# EAGLE design SenseBox-MCU-2-2 (EAGLE 9.6.2)

## Sheet 1 of 2
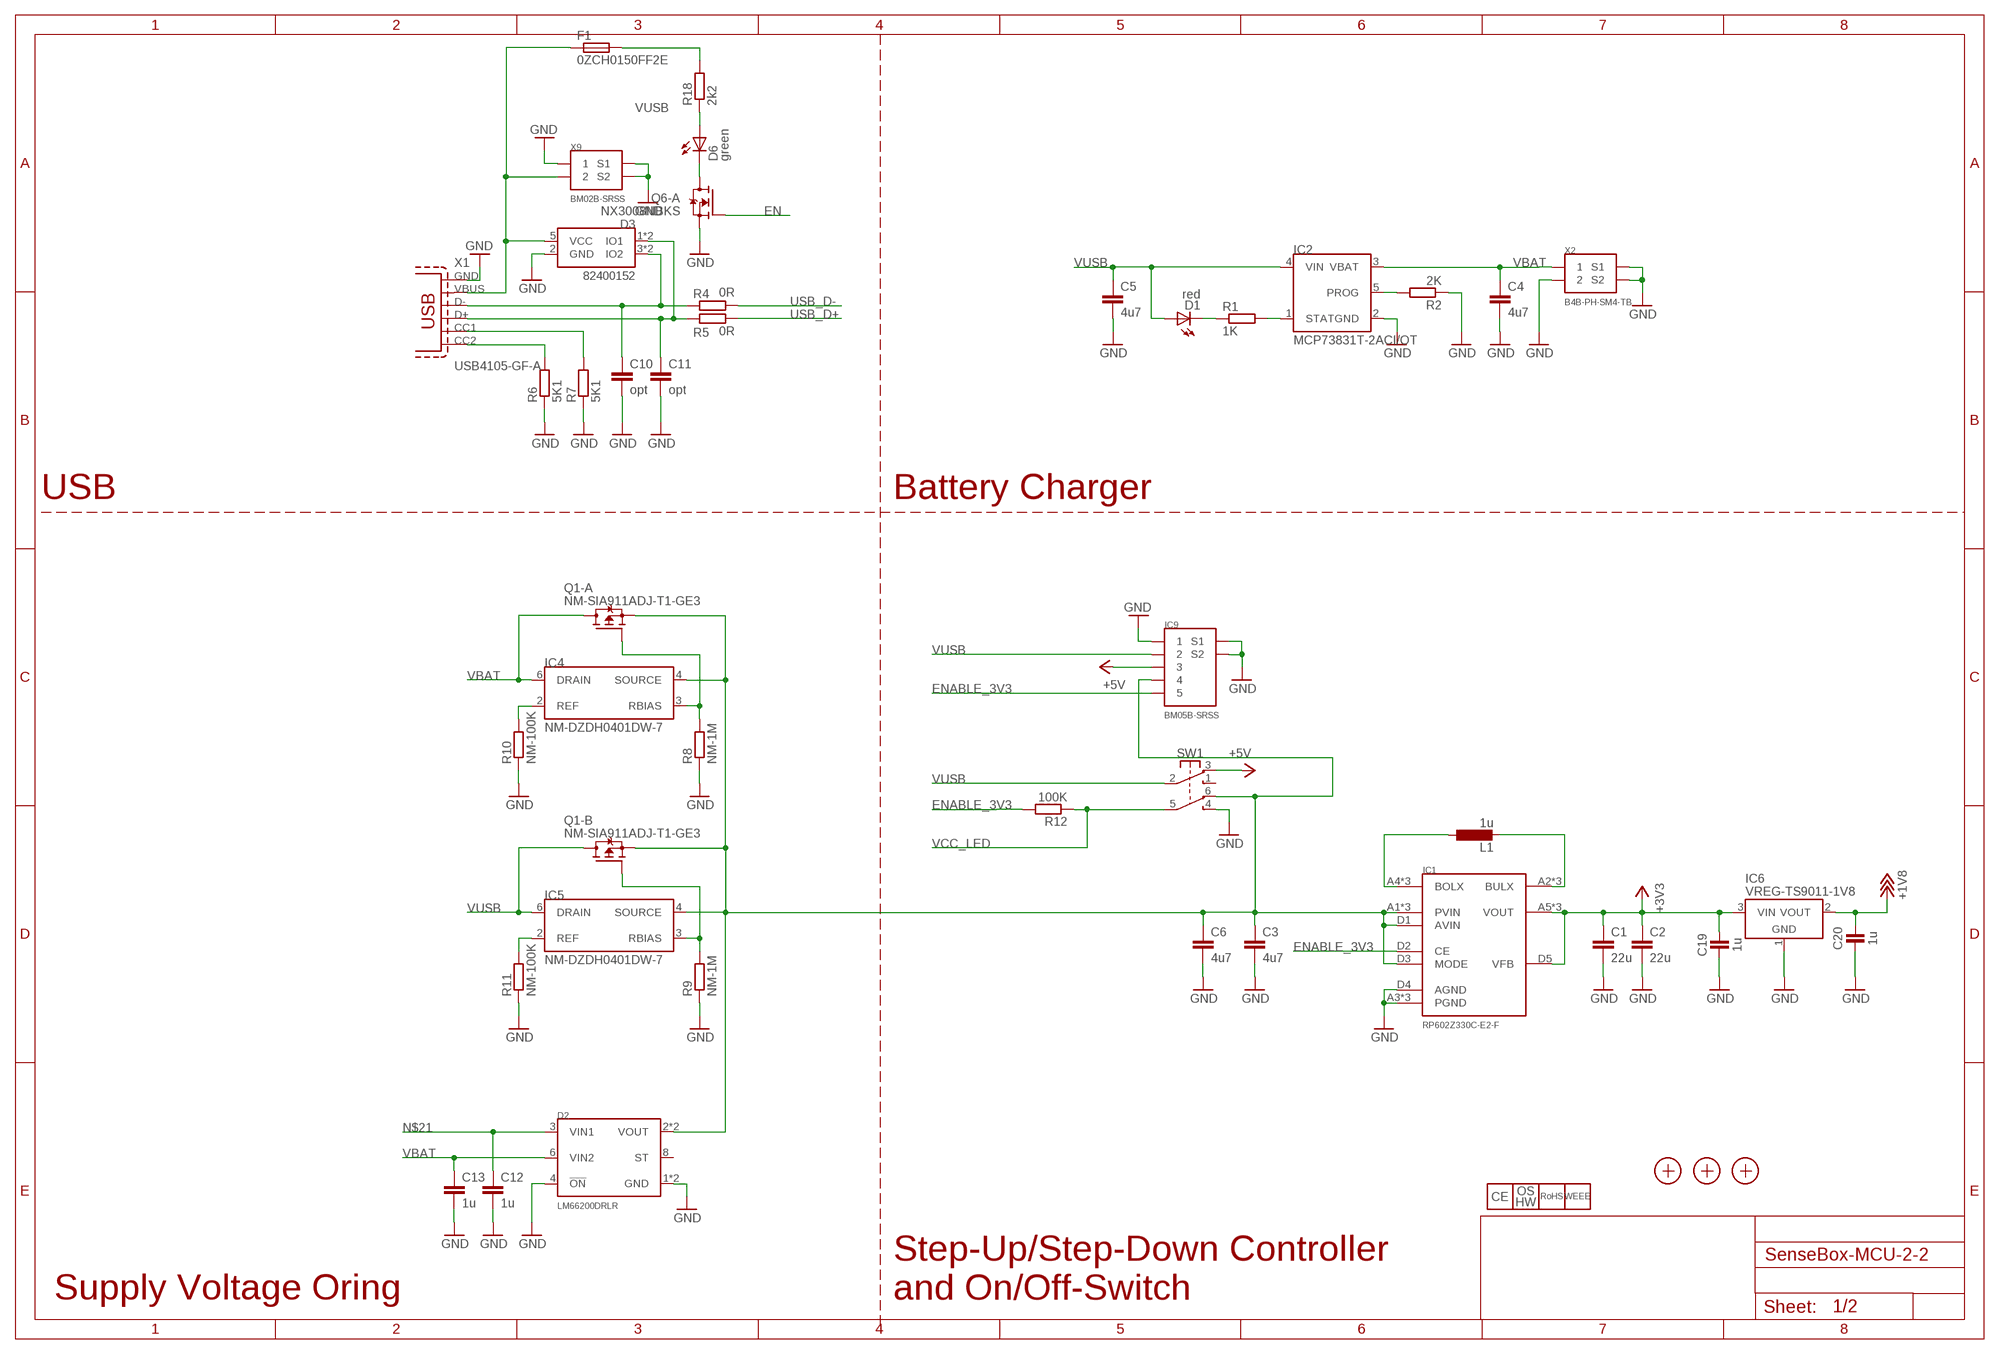
[diagram p0: schematic, sheet 1]

### Parts
C1  22u  C_22U_0805N  [0805N]
C2  22u  C_22U_0805N  [0805N]
C3  4u7  C_4U7_0603N  [0603N]
C4  4u7  C_4U7_0603N  [0603N]
C5  4u7  C_4U7_0603N  [0603N]
C6  4u7  C_4U7_0603N  [0603N]
C10  opt  C_0402N  [0402N]
C11  opt  C_0402N  [0402N]
C12  1u  C_1U_0402N  [0402N]
C13  1u  C_1U_0402N  [0402N]
C19  1u  CAPACITOR-0402  [C0402]
C20  1u  CAPACITOR-0402  [C0402]
D1  red  LED_RED_0603N  [0603N]
D2  LM66200DRLR  LM66200  [SOT-5X3]
D3  82400152  TVS-3-CHANNELS_WE-TVS_SOT563  [SOT563]
D6  green  LED_GREEN_0603N  [0603N]
F1  0ZCH0150FF2E  FUSE-2PIN_1.5A_1210N  [1210N]
IC1  RP602Z330C-E2-F  RP602_RP602Z330C-E2-F_WLCSP-20-P1  [WLCSP-20-P1]
IC2  MCP73831T-2ACI/OT  MCP73831_MCP73831T-2ACI/OT_SOT23-5  [SOT23-5]
IC4  NM-DZDH0401DW-7  DZDH0401DW  [SOT363]
IC5  NM-DZDH0401DW-7  DZDH0401DW  [SOT363]
IC6  VREG-TS9011-1V8  [SOT23]
IC9  BM05B-SRSS  SH-05_BM05B-SRSS_BM05B-SRSS  [BM05B-SRSS]
L1  1u  L_WE-LQS-1U_5040  [5040]
LOGO1  LOGO_CE-2  [CE_2MM]
LOGO2  LOGO_OSHW-2  [OSHW_2MM]
LOGO3  LOGO_ROHS-2  [ROHS_2MM]
LOGO4  LOGO_WEEE-4  [WEEE_4MM]
Q1  NM-SIA911ADJ-T1-GE3  MOSFET-P-DUAL_SIA911ADJ-T1-GE3_POWERPAK-SC70-6  [POWERPAK-SC70-6]
Q6  NX3008NBKS  MOSFET-N-DUAL_NX3008NBKS_SOT363  [SOT363]
R1  1K  R_1K_0402N  [0402N]
R2  2K  R_2K_0402N  [0402N]
R4  0R  R_0R_0402N  [0402N]
R5  0R  R_0R_0402N  [0402N]
R6  5K1  R_5K1_0402N  [0402N]
R7  5K1  R_5K1_0402N  [0402N]
R8  NM-1M  R_1M_0402N  [0402N]
R9  NM-1M  R_1M_0402N  [0402N]
R10  NM-100K  R_100K_0402N  [0402N]
R11  NM-100K  R_100K_0402N  [0402N]
R12  100K  R_100K_0402N  [0402N]
R18  2k2  R_1K_0402N  [0402N]
SW1  SW-2UM-CUS22B  [CUS22B]
X1  USB4105-GF-A  USB-C-2.0_USB4105-GF-A_USB4105  [USB4105]
X2  B4B-PH-SM4-TB  SH-02_B4B-PH-SM4-TB_B4B-PH-SM4-TB  [B4B-PH-SM4-TB]
X9  BM02B-SRSS  SH-02_BM02B-SRSS_BM02B-SRSS  [BM02B-SRSS]
X13  PASSER-07  [PASSER_07MM]
X14  PASSER-07  [PASSER_07MM]
X15  PASSER-07  [PASSER_07MM]

### Nets
+1V8: C20.2 IC6.2(VOUT) ; supply symbol labelled +18V ; also sheet 2
+3V3: C1.1 C2.1 C19.2 IC1.A5(VOUT) IC1.B5(VOUT) IC1.C5(VOUT) IC1.D5(VFB) IC6.3(VIN) ; also sheet 2
+5V: IC9.3 SW1.3(NC1)
EN: Q6.2(-A:G) ; also sheet 2
ENABLE_3V3: IC1.D2(CE) IC9.5 R12.2
GND: C1.2 C2.2 C3.2 C4.2 C5.2 C6.2 C10.2 C11.2 C12.2 C13.2 C19.1 C20.1 D2.1(GND) D2.4(!ON) D2.5(GND) D3.2(GND) IC1.A3(PGND) IC1.B3(PGND) IC1.C3(PGND) IC1.D4(AGND) IC2.2(GND) IC6.1(GND) IC9.1 IC9.S1 IC9.S2 Q6.1(-A:S) R2.1 R6.1 R7.1 R8.1 R9.1 R10.1 R11.1 SW1.4(NO2) X1.A1_B12(GND) X1.B1_A12(GND) X1.S1(GND) X1.S2(GND) X1.S3(GND) X1.S4(GND) X2.2 X2.SH1(S1) X2.SH2(S2) X9.1 X9.S1 X9.S2 ; also sheet 2
N$1: IC1.A4(BOLX) IC1.B4(BOLX) IC1.C4(BOLX) L1.1
N$2: IC1.A2(BULX) IC1.B2(BULX) IC1.C2(BULX) L1.2
N$4: IC2.5(PROG) R2.2
N$6: IC4.2(REF) R10.2
N$7: D1.C R1.1
N$8: IC2.1(STAT) R1.2
N$9: C10.1 D3.3(IO2) D3.4(IO2) R4.1 X1.A7(D-) X1.B7(D-)
N$10: C11.1 D3.1(IO1) D3.6(IO1) R5.1 X1.A6(D+) X1.B6(D+)
N$11: R6.2 X1.B5(CC2)
N$12: R7.2 X1.A5(CC1)
N$13: D3.5(VCC) F1.1 X1.A4_B9(VBUS) X1.B4_A9(VBUS) X9.2
N$14: IC5.2(REF) R11.2
N$15: IC4.3(RBIAS) Q1.2(-A:G) R8.2
N$16: C3.1 C6.1 D2.2(VOUT) D2.7(VOUT) IC1.A1(PVIN) IC1.B1(PVIN) IC1.C1(PVIN) IC1.D1(AVIN) IC1.D3(MODE) IC4.4(SOURCE) IC5.4(SOURCE) IC9.4 Q1.1(-A:S) Q1.4(-B:S) SW1.6(NC2)
N$17: IC5.3(RBIAS) Q1.5(-B:G) R9.2
N$21: C12.1 D2.3(VIN1)
N$27: D6.A R18.1
N$42: D6.C Q6.6(-A:D)
USB_D+: R5.2 ; also sheet 2
USB_D-: R4.2 ; also sheet 2
VBAT: C4.1 C13.1 D2.6(VIN2) IC2.3(VBAT) IC4.6(DRAIN) Q1.6(-A:D) Q1.7(-A:D) X2.1
VCC_LED: R12.1 SW1.5(C2) ; also sheet 2
VUSB: C5.1 D1.A F1.2 IC2.4(VIN) IC5.6(DRAIN) IC9.2 Q1.3(-B:D) Q1.8(-B:D) R18.2 SW1.2(C1)
Unconnected: D2.8(ST) SW1.1(NO1)

### Notes on the sheet
- USB | Battery Charger
- Supply Voltage Oring
- Step-Up/Step-Down Controller 
  and On/Off-Switch

## Sheet 2 of 2
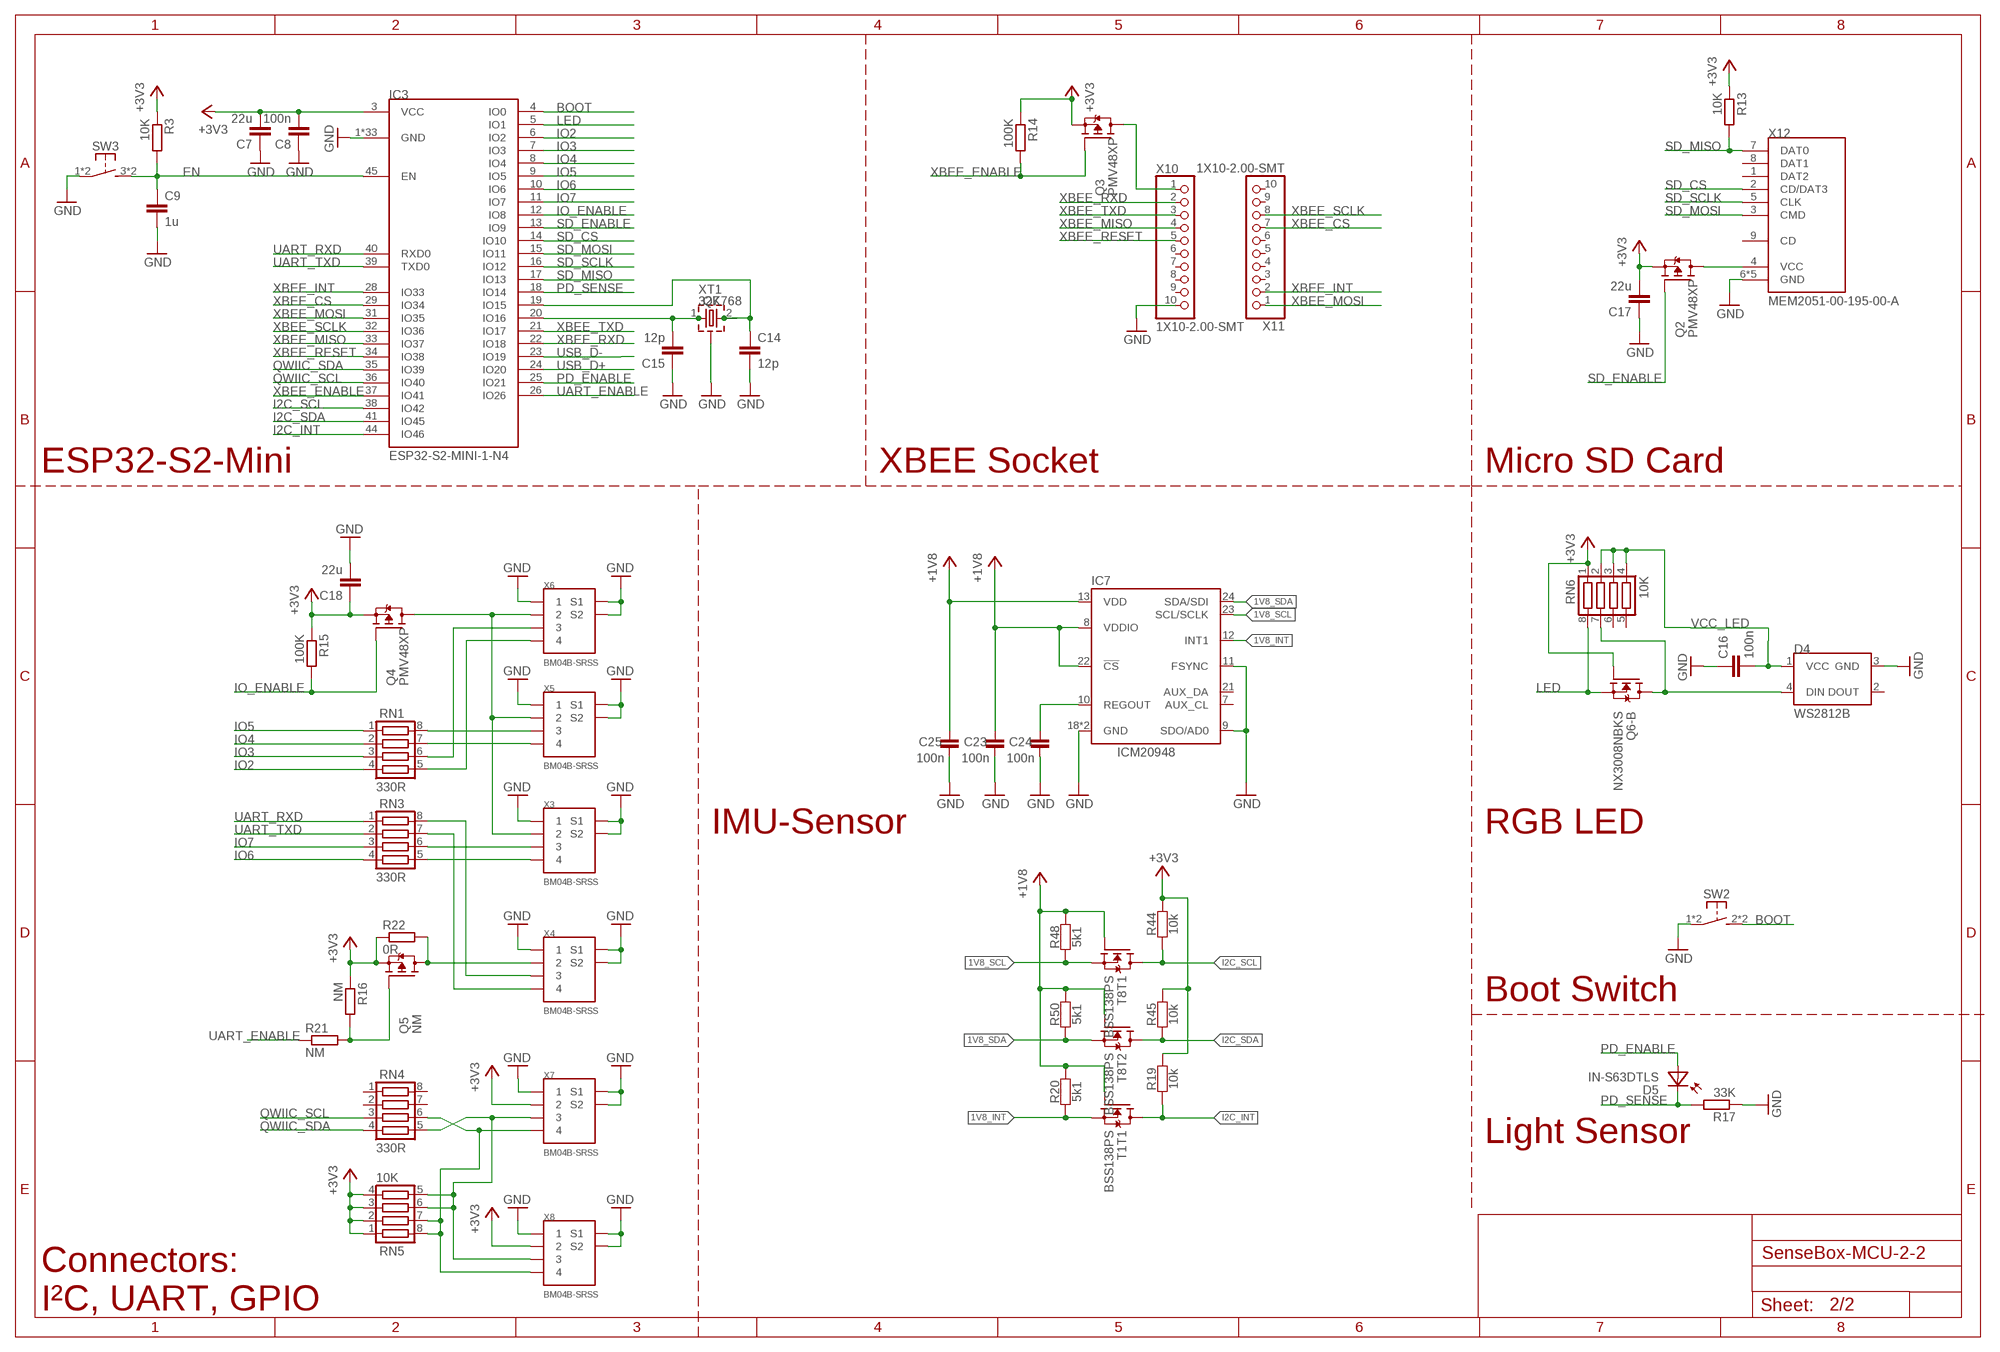
[diagram p1: schematic, sheet 2]

### Parts
C7  22u  C_22U_0805N  [0805N]
C8  100n  C_100N_0402N  [0402N]
C9  1u  C_1U_0402N  [0402N]
C14  12p  C_12P_0402N  [0402N]
C15  12p  C_12P_0402N  [0402N]
C16  100n  C_100N_0402N  [0402N]
C17  22u  C_22U_0805N  [0805N]
C18  22u  C_22U_0805N  [0805N]
C23  100n  CAPACITOR-0402  [C0402]
C24  100n  CAPACITOR-0402  [C0402]
C25  100n  CAPACITOR-0402  [C0402]
D4  WS2812B  LED-ADRESSABLE_WS2812B_5050  [5050]
D5  IN-S63DTLS  PHOTODIODE_IN-S63DTLS_0603N  [0603N]
IC3  ESP32-S2-MINI-1-N4  ESP32-S2-MINI_ESP32-S2-MINI-1-N4_ESP32-S2-MINI  [ESP32-S2-MINI]
IC7  ICM20948  [QFN24-3X3]
Q2  PMV48XP  MOSFET-P_PMV48XP_SOT23'  [SOT23]
Q3  PMV48XP  MOSFET-P_PMV48XP_SOT23'  [SOT23]
Q4  PMV48XP  MOSFET-P_PMV48XP_SOT23'  [SOT23]
Q5  NM  MOSFET-P_PMV48XP_SOT23'  [SOT23]
Q7  CRYSTAL-ZM315  [CRYSTAL_ZM315]
R3  10K  R_10K_0402N  [0402N]
R13  10K  R_10K_0402N  [0402N]
R14  100K  R_100K_0402N  [0402N]
R15  100K  R_100K_0402N  [0402N]
R16  NM  R_100K_0402N  [0402N]
R17  33K  R_33K_0402N  [0402N]
R19  10k  RESISTOR-0402  [C0402]
R20  5k1  RESISTOR-0402  [C0402]
R21  NM  R_100K_0402N  [0402N]
R22  0R  R_100K_0402N  [0402N]
R44  10k  RESISTOR-0402  [C0402]
R45  10k  RESISTOR-0402  [C0402]
R48  5k1  RESISTOR-0402  [C0402]
R50  5k1  RESISTOR-0402  [C0402]
RN1  330R  RN4_330R_CAY16  [CAY16]
RN3  330R  RN4_330R_CAY16  [CAY16]
RN4  330R  RN4_330R_CAY16  [CAY16]
RN5  10K  RN4_10K_CAY16  [CAY16]
RN6  10K  RN4_10K_CAY16  [CAY16]
SW2  SW-TACTILE-TL3365  [TL3365]
SW3  SW-TACTILE-PTS840P  [PTS840P]
T1  BSS138PS  [SOT363]
T8  BSS138PS  [SOT363]
X3  BM04B-SRSS  SH-04_BM04B-SRSS_BM04B-SRSS  [BM04B-SRSS]
X4  BM04B-SRSS  SH-04_BM04B-SRSS_BM04B-SRSS  [BM04B-SRSS]
X5  BM04B-SRSS  SH-04_BM04B-SRSS_BM04B-SRSS  [BM04B-SRSS]
X6  BM04B-SRSS  SH-04_BM04B-SRSS_BM04B-SRSS  [BM04B-SRSS]
X7  BM04B-SRSS  SH-04_BM04B-SRSS_BM04B-SRSS  [BM04B-SRSS]
X8  BM04B-SRSS  SH-04_BM04B-SRSS_BM04B-SRSS  [BM04B-SRSS]
X10  1X10-2.00-SMT  1X10_2.00-SMT  [1X10-2.00-SMD]
X11  1X10-2.00-SMT  1X10_2.00-SMT  [1X10-2.00-SMD]
X12  MEM2051-00-195-00-A  SD-CARD2_MEM2051  [MEM2051]
XT1  32K768  CRYSTAL-1GND_1.4X1.5X5.2  [1.4X1.5X5.2]

### Nets
1V8_INT: IC7.12(INT1) R20.1 T1.1(T1:S)
1V8_SCL: IC7.23(SCL/SCLK) R48.1 T8.1(T1:S)
1V8_SDA: IC7.24(SDA/SDI) R50.1 T8.4(T2:S)
+1V8: C23.2 C25.2 IC7.8(VDDIO) IC7.13(VDD) IC7.22(!CS) R20.2 R48.2 R50.2 T1.2(T1:G) T8.2(T1:G) T8.5(T2:G) ; also sheet 1
+3V3: C7.2 C8.2 C17.2 C18.1 IC3.3(VCC) Q2.2(S) Q3.2(S) Q4.2(S) Q5.2(S) Q6.5(-B:G) R3.1 R13.1 R14.1 R15.1 R16.1 R19.2 R22.1 R44.2 R45.2 RN5.1 RN5.2 RN5.3 RN5.4 RN6.1 X7.2 X8.2 ; also sheet 1
BOOT: IC3.4(IO0) SW2.2(S1) SW2.3(S1)
EN: C9.1 IC3.45(EN) R3.2 SW3.3(S1) SW3.4(S1) ; also sheet 1
GND: C7.1 C8.1 C9.2 C14.2 C15.1 C16.1 C17.1 C18.2 C23.1 C24.1 C25.1 D4.3(GND) IC3.1(GND) IC3.2(GND) IC3.30(GND) IC3.42(GND) IC3.43(GND) IC3.46(GND) IC3.47(GND) IC3.48(GND) IC3.49(GND) IC3.50(GND) IC3.51(GND) IC3.52(GND) IC3.53(GND) IC3.54(GND) IC3.55(GND) IC3.56(GND) IC3.57(GND) IC3.58(GND) IC3.59(GND) IC3.60(GND) IC3.61(GND) IC3.62(GND) IC3.63(GND) IC3.64(GND) IC3.65(GND) IC3.66(GND) IC3.67(GND) IC3.68(GND) IC3.69(GND) IC3.70(GND) IC3.71(GND) IC3.72(GND) IC3.73(GND) IC7.9(SDO/AD0) IC7.11(FSYNC) IC7.18(GND) IC7.20(GND) R17.1 SW2.1 SW2.4(P1) SW3.1 SW3.2(P1) X3.1 X3.S1 X3.S2 X4.1 X4.S1 X4.S2 X5.1 X5.S1 X5.S2 X6.1 X6.S1 X6.S2 X7.1 X7.S1 X7.S2 X8.1 X8.S1 X8.S2 X10.10 X12.6(GND) X12.S1(GND) X12.S2(GND) X12.S3(GND) X12.S4(GND) XT1.3(GND) ; also sheet 1
I2C_INT: IC3.44(IO46) R19.1 T1.6(T1:D)
I2C_SCL: IC3.38(IO42) R44.1 T8.6(T1:D)
I2C_SDA: IC3.41(IO45) R45.1 T8.3(T2:D)
IO2: IC3.6(IO2) RN1.4
IO3: IC3.7(IO3) RN1.3
IO4: IC3.8(IO4) RN1.2
IO5: IC3.9(IO5) RN1.1
IO6: IC3.10(IO6) RN3.4
IO7: IC3.11(IO7) RN3.3
IO_ENABLE: IC3.12(IO8) Q4.1(G) R15.2
LED: IC3.5(IO1) Q6.4(-B:S) RN6.8
N$3: RN1.6 X6.3
N$5: C15.2 IC3.20(IO16) Q7.1 XT1.1
N$18: C14.1 IC3.19(IO15) Q7.2 XT1.2
N$19: D4.4(DIN) Q6.3(-B:D) RN6.7
N$20: Q4.3(D) X3.2 X5.2 X6.2
N$22: Q2.3(D) X12.4(VCC)
N$23: Q3.3(D) X10.1
N$24: Q5.3(D) R22.2 X4.2
N$31: RN1.5 X6.4
N$32: RN1.8 X5.3
N$33: RN1.7 X5.4
N$34: RN3.5 X3.4
N$35: RN3.6 X3.3
N$36: RN3.8 X4.3
N$37: RN3.7 X4.4
N$38: RN4.6 RN5.7 RN5.8 X7.4 X8.4
N$39: RN4.5 RN5.5 RN5.6 X7.3 X8.3
PD_ENABLE: D5.A IC3.25(IO21)
PD_SENSE: D5.C IC3.18(IO14) R17.2
QWIIC_SCL: IC3.36(IO40) RN4.3
QWIIC_SDA: IC3.35(IO39) RN4.4
REGOUT1: C24.2 IC7.10(REGOUT)
SD_CS: IC3.14(IO10) X12.2(CD/DAT3)
SD_ENABLE: IC3.13(IO9) Q2.1(G)
SD_MISO: IC3.17(IO13) R13.2 X12.7(DAT0)
SD_MOSI: IC3.15(IO11) X12.3(CMD)
SD_SCLK: IC3.16(IO12) X12.5(CLK)
UART_ENABLE: IC3.26(IO26) R21.1
UART_ENABLE1: Q5.1(G) R16.2 R21.2
UART_RXD: IC3.40(RXD0) RN3.1
UART_TXD: IC3.39(TXD0) RN3.2
USB_D+: IC3.24(IO20) ; also sheet 1
USB_D-: IC3.23(IO19) ; also sheet 1
VCC_LED: C16.2 D4.1(VCC) RN6.2 RN6.3 RN6.4 ; also sheet 1
XBEE_CS: IC3.29(IO34) X11.7
XBEE_ENABLE: IC3.37(IO41) Q3.1(G) R14.2
XBEE_INT: IC3.28(IO33) X11.2
XBEE_MISO: IC3.33(IO37) X10.4
XBEE_MOSI: IC3.31(IO35) X11.1
XBEE_RESET: IC3.34(IO38) X10.5
XBEE_RXD: IC3.22(IO18) X10.2
XBEE_SCLK: IC3.32(IO36) X11.8
XBEE_TXD: IC3.21(IO17) X10.3
Unconnected: D4.2(DOUT) IC7.7(AUX_CL) IC7.21(AUX_DA) RN4.1 RN4.2 RN4.7 RN4.8 RN6.5 RN6.6 T1.3(T2:D) T1.4(T2:S) T1.5(T2:G) X10.6 X10.7 X10.8 X10.9 X11.3 X11.4 X11.5 X11.6 X11.9 X11.10 X12.1(DAT2) X12.8(DAT1) X12.9(CD)

### Notes on the sheet
- ESP32-S2-Mini | XBEE Socket | Micro SD Card
- IMU-Sensor | RGB LED
- Boot Switch
- Light Sensor
- Connectors:
  I²C, UART, GPIO

## Library data of the parts
C1 C2 C7 C17 C18 = BE_capacitor:C: Capacitor; BE#: 208; DIELECTRIC: X5R; VOLTAGE: 6V3
C3-C6 = BE_capacitor:C: Capacitor; BE#: 284; DIELECTRIC: X5R; VOLTAGE: 6V3
C8 C16 = BE_capacitor:C: Capacitor; BE#: 756; DIELECTRIC: X7R; VOLTAGE: 16
C9 C12 C13 = BE_capacitor:C: Capacitor; BE#: 901; DIELECTRIC: X5R; VOLTAGE: 10
C10 C11 = BE_capacitor:C: Capacitor; BE#: 0
C14 C15 = BE_capacitor:C: Capacitor; BE#: 754; DIELECTRIC: NPO; VOLTAGE: 50
C19 C20 C23-C25 = we-rcl:CAPACITOR: Capacitor ...2.2uF @ 6.3V -> 0402 ...4.7uF @ 6.3V -> 0603 ...10uF @ 16V -> 0805 ...22uF @ 25V -> 1206
D1 = BE_opto:LED: Single LED; BE#: 224
D2 = BE_diode:LM66200: LM66200 1.6-5V, 2.5A Dual Ideal Diode with Automatic Switchover; BE#: 2291
D3 = BE_diode:TVS-3-CHANNELS: TVS Suppressor Diodes Array; BE#: 2015
D4 = BE_opto:LED-ADRESSABLE: Adressable LED with Data-In and Data-Out Pins; BE#: 2295
D5 = BE_opto:PHOTODIODE: Photo diode; BE#: 2296
D6 = BE_opto:LED: Single LED; BE#: 223
F1 = BE_fuse:FUSE-2PIN: Fuse with two Pins.; BE#: 2289; CURRENT: 1.5
IC1 = BE_dcdc:RP602: 1.5 A PWM/VFM Buck-Boost DC/DC Converter with Synchronous Rectifier; BE#: 2281
IC2 = BE_dcdc:MCP73831: Miniature Single-Cell, Fully Integrated Li-Ion, Li-Polymer Charge Management Controllers up to 500mA; BE#: 2283
IC3 = BE_wireless:ESP32-S2-MINI: 2.4 GHz Wi­Fi (802.11 b/g/n) module built around ESP32-S2 series of SoCs, Xtensa Single Core 32-bit LX7 Microprocessor; BE#: 2275
IC4 IC5 = BE_diode:DZDH0401DW: Ideal Diode Controller; BE#: 2290; VALUE: DZDH0401DW-7
IC6 = we-power:VREG: Voltage Regulator LDOs Taiwan Semi TS1117 800mA max 15V - compatible On Semi NCP1117 1A max 20V - compatible Diodes AP2111H 0.6A max 6V (0.25V@0.6A) - compatible Diodes AP2114H 1A max 6V (0.45V@1A) Taiwan Semi TS9011 250mA max 12V - compatible Diodes AP2210 300mA max 15V - compatible Microchip MCP1700 250mA max 6.5V - compatible Microchip MCP1702 250mA max 13V - compatible Microchip MCP1703 250mA max 16V - compatible Microchip MCP1754 150mA max 16V Taiwan Semi TS5204 80mA max 16V (low noise) - compatible Diodes AP7313-xxSA 150mA max 6V - compatible Diodes AP7333-xxSA 300mA max 6V DC/DC Converter Modules Recom R-78Ex.x-1.0-W36 1A max 28V - compatible CUI V78xx-2000 2A max 18V Murata OKI-78SR-x.x/1.5-W36 1.5A max 36V
IC7 = we-sensor:ICM20948
IC9 = BE_connector:SH-05: SH Connector; BE#: 2369
L1 = BE_inductor:L: Inductor; BE#: 2282; CURRENT: 4.9; INDUCTANCE: 1u
LOGO1 = we-symbol:LOGO_CE: CE Logo
LOGO2 = we-symbol:LOGO_OSHW: Open-Source-Hardware Logo
LOGO3 = we-symbol:LOGO_ROHS: RoHS Logo
LOGO4 = we-symbol:LOGO_WEEE: WEEE Logo
Q1 = BE_transistor:MOSFET-P-DUAL: Dual Mosfet with Common Drain Pins; BE#: 2292; CURRENT: 4.5; VALUE: SIA911ADJ-T1-GE3; VOLTAGE: 20
Q2-Q4 = BE_transistor:MOSFET-P: Single P-Channel Mosfet; BE#: 271; CURRENT: 3.5; VOLTAGE: 20
Q5 = BE_transistor:MOSFET-P: Single P-Channel Mosfet; BE#: 271; CURRENT: 3.5; VALUE: PMV48XP; VOLTAGE: 20
Q6 = BE_transistor:MOSFET-N-DUAL: Dual Mosfet; BE#: 405; CURRENT: 0.35; POWER: 0.3; VOLTAGE: 30
Q7 = we-rcl:CRYSTAL: Crystal
R1 = BE_resistor:R: Resistor; BE#: 1088; POWER: 0.063; TEMPERATURE_COEFFICIENT: 100; TOLERANCE: 1%; VOLTAGE: 50
R2 = BE_resistor:R: Resistor; BE#: 1057; POWER: 0.063; TEMPERATURE_COEFFICIENT: 100; TOLERANCE: 1%; VOLTAGE: 50
R3 R13 = BE_resistor:R: Resistor; BE#: 616; POWER: 0.063; TEMPERATURE_COEFFICIENT: 100; TOLERANCE: 1%; VOLTAGE: 50
R4 R5 = BE_resistor:R: Resistor; BE#: 1054
R6 R7 = BE_resistor:R: Resistor; BE#: 2285; POWER: 0.063; TEMPERATURE_COEFFICIENT: 100; TOLERANCE: 1%; VOLTAGE: 50
R8 R9 = BE_resistor:R: Resistor; BE#: 1089; POWER: 0.063; TEMPERATURE_COEFFICIENT: 100; TOLERANCE: 1%; VALUE: 1M; VOLTAGE: 50
R10 R11 R16 R21 R22 = BE_resistor:R: Resistor; BE#: 615; POWER: 0.063; TEMPERATURE_COEFFICIENT: 100; TOLERANCE: 1%; VALUE: 100K; VOLTAGE: 50
R12 R14 R15 = BE_resistor:R: Resistor; BE#: 615; POWER: 0.063; TEMPERATURE_COEFFICIENT: 100; TOLERANCE: 1%; VOLTAGE: 50
R17 = BE_resistor:R: Resistor; BE#: 1428; POWER: 0.063; TEMPERATURE_COEFFICIENT: 100; TOLERANCE: 1%; VOLTAGE: 50
R18 = BE_resistor:R: Resistor; BE#: 1088; POWER: 0.063; TEMPERATURE_COEFFICIENT: 100; TOLERANCE: 1%; VALUE: 1K; VOLTAGE: 50
R19 R20 R44 R45 R48 R50 = we-rcl:RESISTOR: Resistor all kinds in 0402 and 0603
RN1 RN3 RN4 = BE_resistor:RN4: Quad Resistor Net; BE#: 483; POWER: 0.062; TOLERANCE: 5%; VOLTAGE: 50
RN5 RN6 = BE_resistor:RN4: Quad Resistor Net; BE#: 196; POWER: 0.062; TOLERANCE: 5%; VOLTAGE: 50
SW1 = we-switch:SW-2UM: Switch; DIGIKEY: 563-1105-6-ND
SW2 = we-switch:SW-TACTILE: Tactile Switch
SW3 = we-switch:SW-TACTILE: Tactile Switch; DIGIKEY: CKN10511DKR-ND
T1 T8 = we-transistor:BSS138PS: BSS138 Dual N-Chn MOSFET (Vgs>=+/-20V, Vds>=40V, Id>=0.2A + Rds<=3Ohm @ Vgs=4.5V) BSS138PS compatible: 2N7002PS, Si1926DL, BSS138BKS (with ESD protection)
X1 = BE_connector:USB-C-2.0: USB-C Connector with USB 2.0 Support; BE#: 2284
X2 = BE_connector:SH-02: SH Connector; BE#: 2370
X3-X8 = BE_connector:SH-04: SH Connector; BE#: 2287
X9 = BE_connector:SH-02: SH Connector; BE#: 2286
X10 X11 = BE_pinheader:1X10: Pin Header; BE#: 2288
X12 = BE_connector:SD-CARD2: SD Card with Card Detection (Single Pin Contacting GND); BE#: 2293
X13-X15 = we-symbol:PASSER: Fiducial Marker
XT1 = BE_crystal:CRYSTAL-1GND: Crystal with one Ground Terminal; BE#: 830

## Board
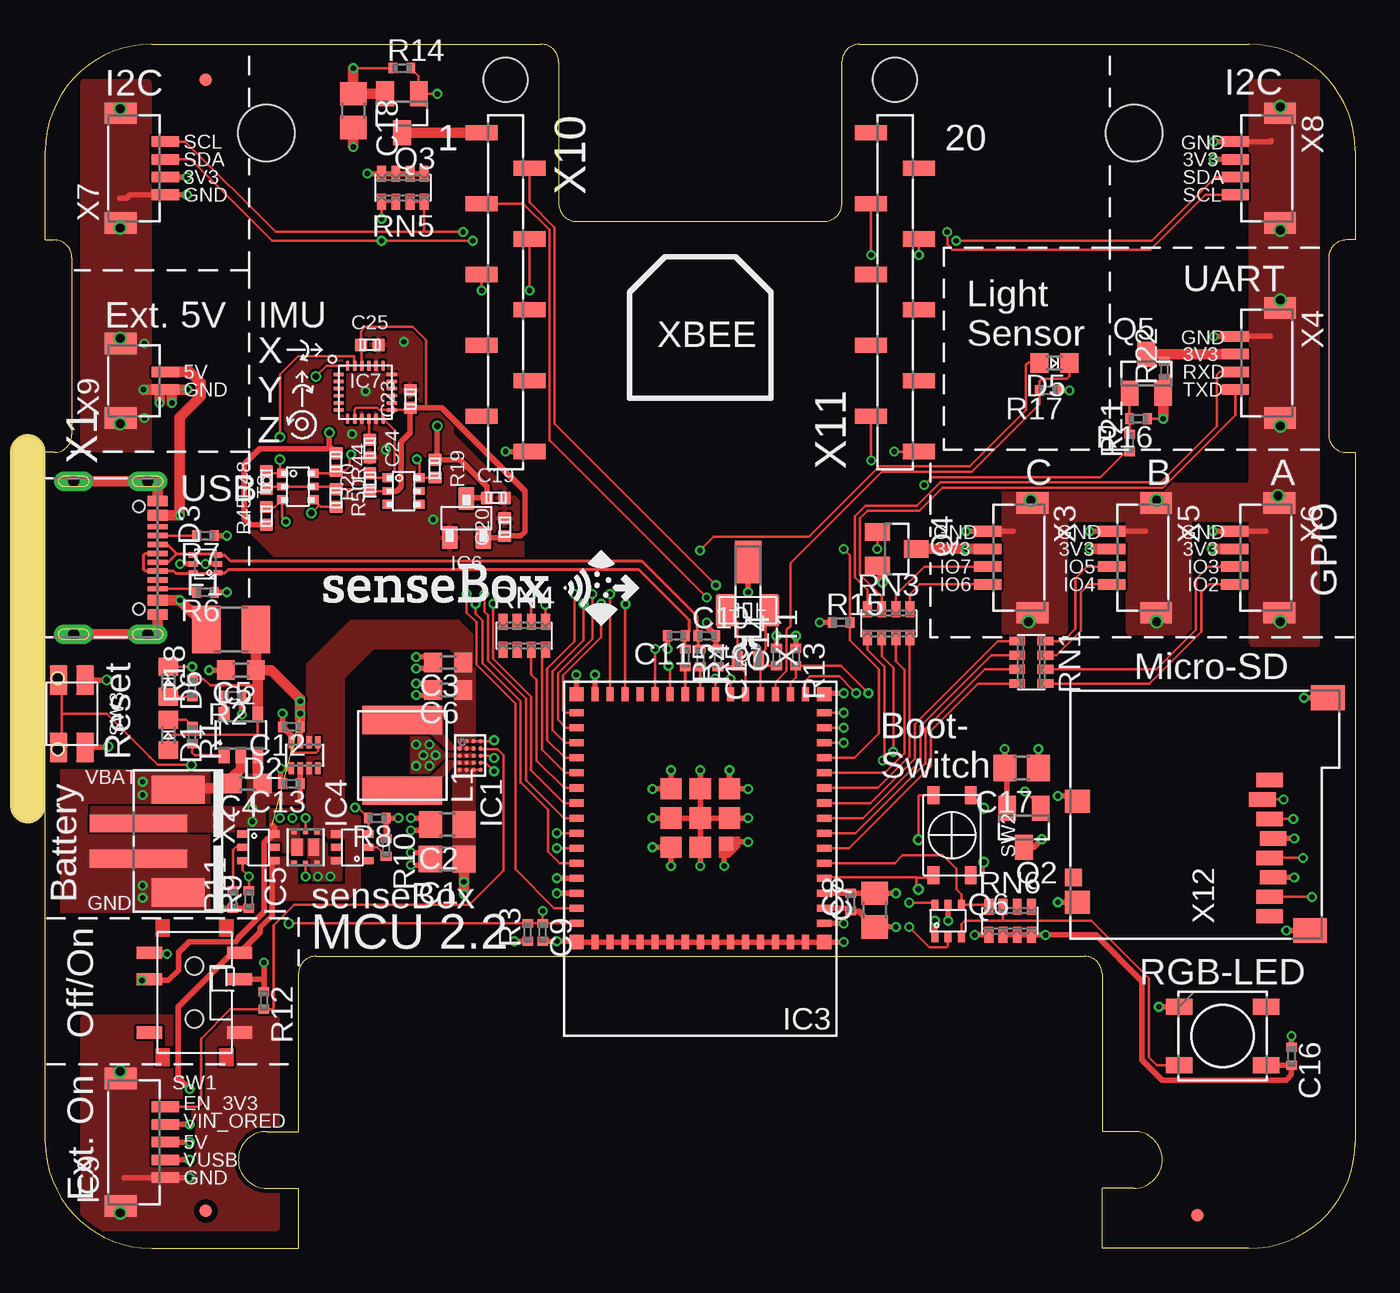
[diagram p2: board, top side]
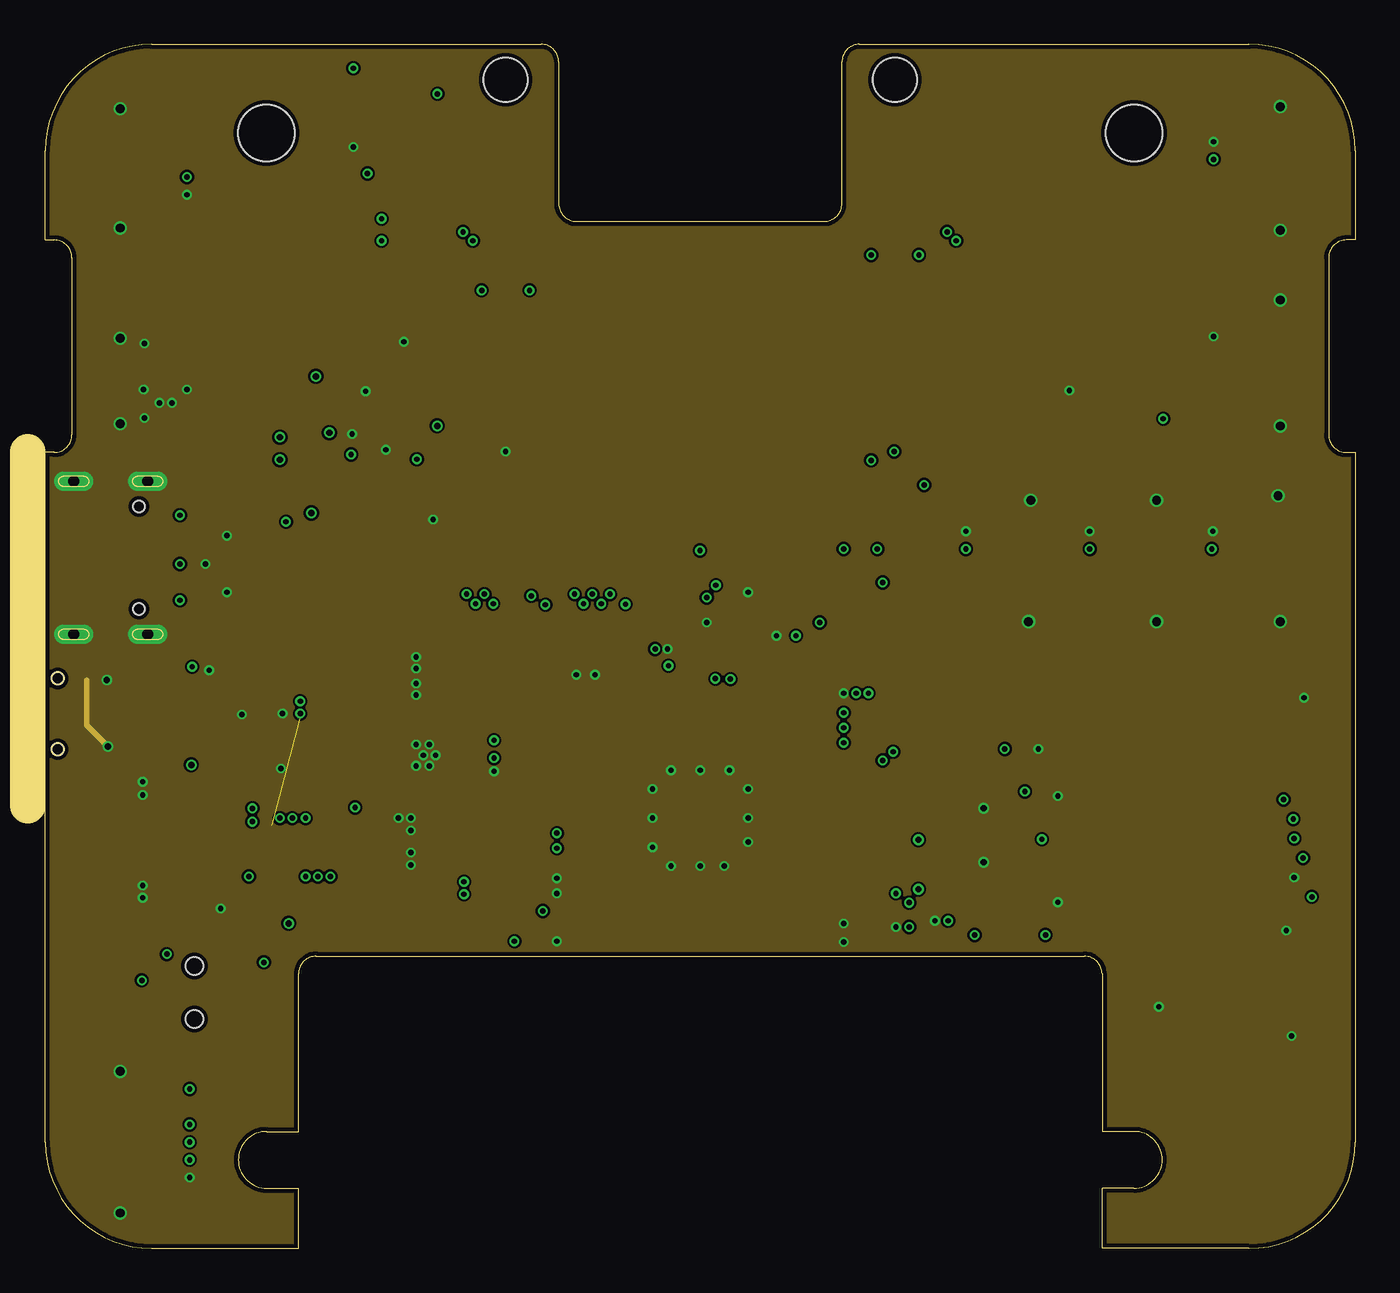
[diagram p3: board, inner layer Route2]
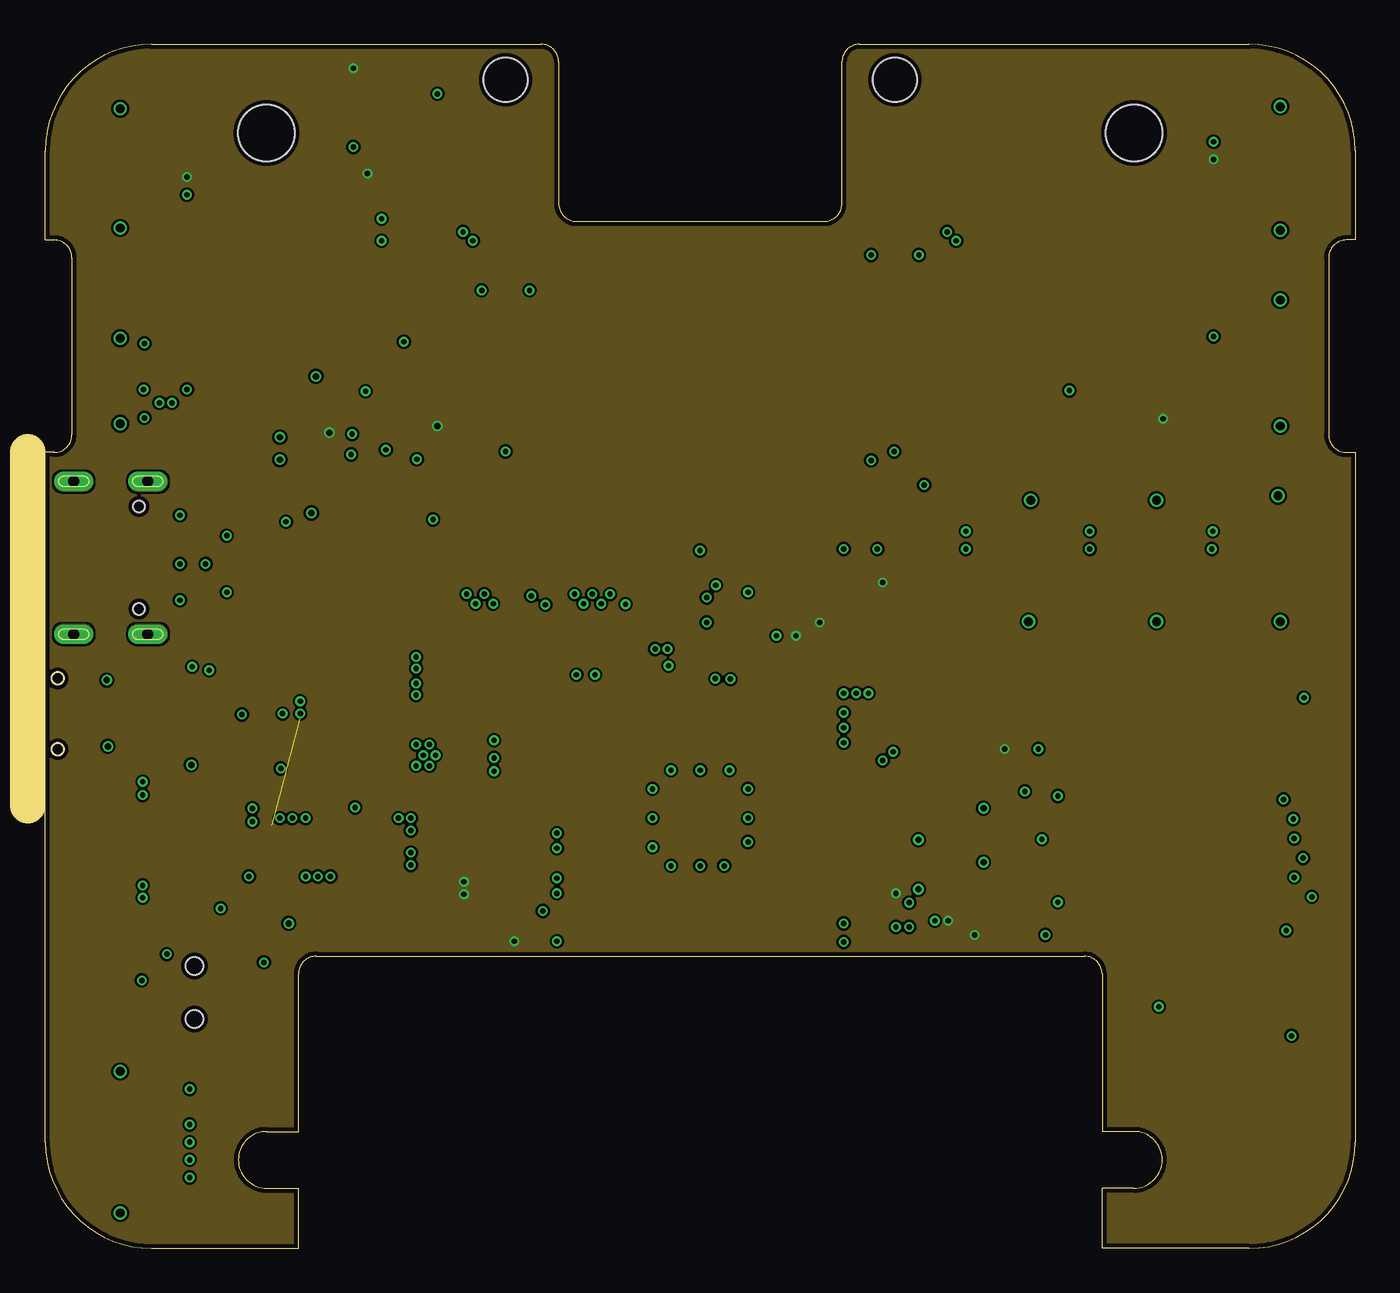
[diagram p4: board, inner layer Route15]
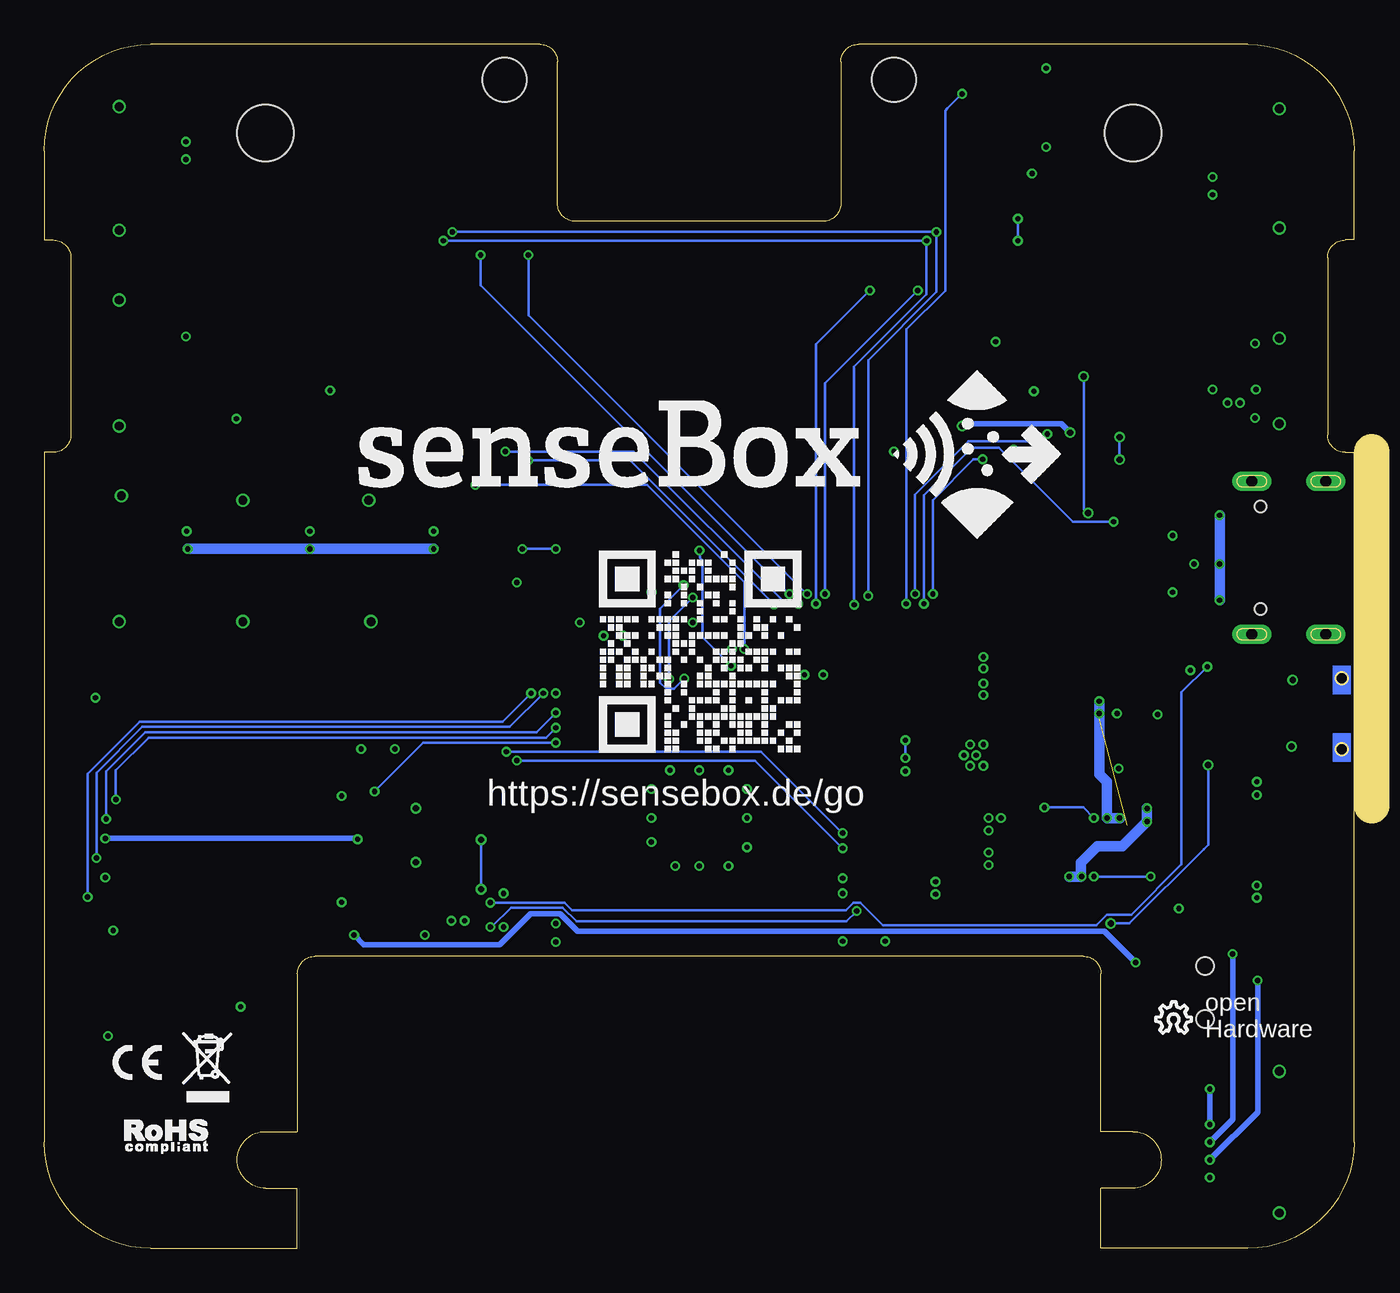
[diagram p5: board, bottom side, seen from below]

Size 74 x 68 mm. Coordinates in mm from the lower left corner, seen from the top.
Outline: 0,56.95 0,62 arc-90 6,68 28,68 arc-90 29,67 29,59 arc90 30,58 44,58 arc90 45,59 45,67 arc-90 46,68 68,68 arc-90 74,62 74,56.95 73.5,56.95 arc90 72.5,55.95 72.5,45.95 arc90 73.5,44.95 74,44.95 74,6 arc-90 68,0 59.7,0 59.7,3.4 61.5,3.4 arc90 63.1,5 arc90 61.5,6.6 59.7,6.6 59.7,15.5 arc90 58.7,16.5 15.3,16.5 arc90 14.3,15.5 14.3,6.6 12.5,6.6 arc90 10.9,5 arc90 12.5,3.4 14.3,3.4 14.3,0 6,0 arc-90 0,6 0,44.95 0.5,44.95 arc90 1.5,45.95 1.5,55.95 arc90 0.5,56.95 0,56.95
Copper layers (1+2*15+16): Top 0.035mm / dielectric 0.1mm / Route2 0.0175mm / dielectric 1.265mm / Route15 0.0175mm / dielectric 0.1mm / Bottom 0.035mm
Design rules "default *": minimum track width 0.125mm, minimum drill 0.3mm, track to track 0.125mm, track to pad 0.125mm, pad to pad 0.125mm, via to via 0.125mm, smd to smd 0.125mm, copper to edge 0.25mm, drill to drill 0.25mm, minimum pad ring 10mil, minimum via ring 0.125mm, stop-mask expansion 4mil, vias tented up to drill 0.4mm, thermal gap 0.125mm
Holes 3.2 mm at 12.5,63 61.5,63
Holes 2.5 mm at 48,66 26,66
tKeepout: area 9.5,60 to 15.5,66; area 58.5,60 to 64.5,66; area 58.5,2 to 64.5,8; area 9.5,2 to 15.5,8
Milling: 1 lines

### Footprints (pad centres in the part's own frame; a part is rotated, then mirrored left to right if it is on the bottom)
0805N = smd 1.3 x 1.5: 1 -0.95,0; 2 0.95,0
0603N = smd 1 x 1.1: 1 -0.85,0; 2 0.85,0
0402N = smd 0.5 x 0.6: 1 -0.5,0; 2 0.5,0
C0402 = smd 0.75 x 0.7: 1 0,0.5; 2 0,-0.5
0603N' = smd 1 x 1.1: A 0.85,0; C -0.85,0
SOT-5X3 = smd 0.3 x 0.67: 1 -0.75,-0.74; 2 -0.25,-0.74; 3 0.25,-0.74; 4 0.75,-0.74; 5 0.75,0.74; 6 0.25,0.74; 7 -0.25,0.74; 8 -0.75,0.74
SOT563 = smd 0.3 x 0.5: 1 -0.5,-0.7; 2 0,-0.7; 3 0.5,-0.7; 4 0.5,0.7; 5 0,0.7; 6 -0.5,0.7
5050 = smd 0.9 x 1.5: 1 -1.65,-2.45; 2 1.65,-2.45; 3 1.65,2.45; 4 -1.65,2.45
1210N = smd 1.6 x 2.7: 1 -1.4,0; 2 1.4,0
WLCSP-20-P1 = smd 0.265 x 0.265: A1 -0.8,-0.6; A2 -0.4,-0.6; A3 0,-0.6; A4 0.4,-0.6; A5 0.8,-0.6; B1 -0.8,-0.2; B2 -0.4,-0.2; B3 0,-0.2; B4 0.4,-0.2; B5 0.8,-0.2; C1 -0.8,0.2; C2 -0.4,0.2; C3 0,0.2; C4 0.4,0.2; C5 0.8,0.2; D1 -0.8,0.6; D2 -0.4,0.6; D3 0,0.6; D4 0.4,0.6; D5 0.8,0.6
SOT23-5 = smd 0.6 x 0.9: 1 -0.95,-1.15; 2 0,-1.15; 3 0.95,-1.15; 4 0.95,1.15; 5 -0.95,1.15
ESP32-S2-MINI = smd 0.4 x 0.8: 1 -3.65,-7; 2 -2.8,-7; 3 -1.95,-7; 4 -1.1,-7; 5 -0.25,-7; 6 0.6,-7; 7 1.45,-7; 8 2.3,-7; 9 3.15,-7; 10 4,-7; 11 4.85,-7; 12 5.7,-7; 13 6.55,-7; 14 7.4,-7; 15 8.25,-7; 31 8.25,7; 32 7.4,7; 33 6.55,7; 34 5.7,7; 35 4.85,7; 36 4,7; 37 3.15,7; 38 2.3,7; 39 1.45,7; 40 0.6,7; 41 -0.25,7; 42 -1.1,7; 43 -1.95,7; 44 -2.8,7; 45 -3.65,7 | smd 0.8 x 0.4: 16 9.3,-5.95; 17 9.3,-5.1; 18 9.3,-4.25; 19 9.3,-3.4; 20 9.3,-2.55; 21 9.3,-1.7; 22 9.3,-0.85; 23 9.3,0; 24 9.3,0.85; 25 9.3,1.7; 26 9.3,2.55; 27 9.3,3.4; 28 9.3,4.25; 29 9.3,5.1; 30 9.3,5.95; 46 -4.7,5.95; 47 -4.7,5.1; 48 -4.7,4.25; 49 -4.7,3.4; 50 -4.7,2.55; 51 -4.7,1.7; 52 -4.7,0.85; 53 -4.7,0; 54 -4.7,-0.85; 55 -4.7,-1.7; 56 -4.7,-2.55; 57 -4.7,-3.4; 58 -4.7,-4.25; 59 -4.7,-5.1; 60 -4.7,-5.95 | smd 1.2 x 1.2: 61 2.3,0; 67 2.3,-1.65; 68 3.95,-1.65; 69 3.95,0; 70 3.95,1.65; 71 2.3,1.65; 72 0.65,1.65; 73 0.65,0 | smd 0.8 x 0.8: 62 -4.7,-7; 63 9.3,-7; 64 9.3,7; 65 -4.7,7; 66 0.85,-1.45
SOT363 = smd 0.4 x 0.6: 1 -0.75,-0.9; 2 0,-0.9; 3 0.75,-0.9; 4 0.75,0.9; 5 0,0.9; 6 -0.75,0.9
SOT23 = smd 1.3 x 0.9: 1 -1.1,0.95; 2 -1.1,-0.95; 3 1.1,0
QFN24-3X3 = smd 0.6 x 0.22: 1 -1.5,1; 2 -1.5,0.6; 3 -1.5,0.2; 4 -1.5,-0.2; 5 -1.5,-0.6; 6 -1.5,-1; 13 1.5,-1; 14 1.5,-0.6; 15 1.5,-0.2; 16 1.5,0.2; 17 1.5,0.6; 18 1.5,1 | smd 0.22 x 0.6: 7 -1,-1.5; 8 -0.6,-1.5; 9 -0.2,-1.5; 10 0.2,-1.5; 11 0.6,-1.5; 12 1,-1.5; 19 1,1.5; 20 0.6,1.5; 21 0.2,1.5; 22 -0.2,1.5; 23 -0.6,1.5; 24 -1,1.5
BM05B-SRSS = smd 0.6 x 1.55: 1 -2,-1.775; 2 -1,-1.775; 3 0,-1.775; 4 1,-1.775; 5 2,-1.775 | smd 1.2 x 1.8: S1 -3.6,0.75; S2 3.6,0.75
5040 = smd 1.6 x 4.5: 1 -2,0; 2 2,0
POWERPAK-SC70-6 = smd 0.3 x 0.325: 1 -0.65,-0.912; 2 0,-0.912; 3 0.65,-0.912; 4 0.65,0.912; 5 0,0.912; 6 -0.65,0.912 | smd 0.613 x 0.95: 7 -0.467,0; 8 0.467,0
SOT23' = smd 1 x 1.4: 1 -0.95,-1.1; 2 0.95,-1.1; 3 0,1.1
CRYSTAL_ZM315 = smd 1.8 x 1.1: 1 0,1.25; 2 0,-1.25
CAY16 = smd 0.5 x 0.9: 1 -1.2,-0.8; 2 -0.4,-0.8; 3 0.4,-0.8; 4 1.2,-0.8; 5 1.2,0.8; 6 0.4,0.8; 7 -0.4,0.8; 8 -1.2,0.8
CUS22B = smd 0.7 x 1.5: 1 -2.25,2.55; 2 0.75,2.55; 3 2.25,2.55; 4 -2.25,-2.55; 5 0.75,-2.55; 6 2.25,-2.55 | hole 1: -1.5,0; 1.5,0
TL3365 = smd 1 x 0.7: 1 -2.25,1.05; 2 -2.25,-1.05; 3 2.25,-1.05; 4 2.25,1.05
PTS840P = smd 1.65 x 1: 1 -1.9,0.75; 2 1.9,0.75; 3 -1.9,-0.75; 4 1.9,-0.75 | hole 0.7: -2,-0.8; 2,-0.8
SOT363' = smd 0.6 x 0.5: 1 -0.9,0.75; 3 -0.9,-0.75; 4 0.9,-0.75; 6 0.9,0.75 | smd 0.6 x 0.4: 2 -0.9,0; 5 0.9,0
USB4105 = smd 0.6 x 1.15: A1_B12 3.2,-3.35; A4_B9 2.4,-3.35; B1_A12 -3.2,-3.35; B4_A9 -2.4,-3.35 | smd 0.3 x 1.15: A5 1.25,-3.35; A6 0.25,-3.35; A7 -0.25,-3.35; A8 -1.25,-3.35; B5 -1.75,-3.35; B6 -0.75,-3.35; B7 0.75,-3.35; B8 1.75,-3.35 | drill 0.6 pad 1 long: S1 -4.32,-2.78; S2 4.32,-2.78; S3 4.32,1.4; S4 -4.32,1.4 | hole 0.65: -2.89,-2.28; 2.89,-2.28
B4B-PH-SM4-TB = smd 1 x 5.5: 1 -1,-2.25; 2 1,-2.25 | smd 1.6 x 3: SH1 -2.9,0; SH2 2.9,0
BM04B-SRSS = smd 0.6 x 1.55: 1 -1.5,-1.775; 2 -0.5,-1.775; 3 0.5,-1.775; 4 1.5,-1.775 | smd 1.2 x 1.8: S1 -3.1,0.75; S2 3.1,0.75
BM02B-SRSS = smd 0.6 x 1.55: 1 -0.5,-1.775; 2 0.5,-1.775 | smd 1.2 x 1.8: S1 -2.1,0.75; S2 2.1,0.75
1X10-2.00-SMD = smd 0.86 x 1.8: 1 -9,-1.35; 2 -7,1.35; 3 -5,-1.35; 4 -3,1.35; 5 -1,-1.35; 6 1,1.35; 7 3,-1.35; 8 5,1.35; 9 7,-1.35; 10 9,1.35
MEM2051 = smd 0.8 x 1.5: 1 1.95,-4.15; 2 0.85,-3.75; 3 -0.25,-4.15; 4 -1.35,-4.35; 5 -2.45,-4.15; 6 -3.55,-4.35; 7 -4.65,-4.15; 8 -5.75,-4.15 | smd 1 x 0.95: 9 -3.55,6.925 | smd 1.4 x 1.9: S1 6.6,-7.45; S2 -6.55,-6.45 | smd 1.3 x 1.4: S3 0.75,6.7; S4 -4.95,6.7
PASSER_07MM = smd 0.7 x 0.7: X 0,0
1.4X1.5X5.2 = smd 0.6 x 1.1: 1 -0.6,0; 2 0.6,0 | smd 1.5 x 2.4: 3 0,5.55

### Placement (x,y rotation side)
C1  22.7,21.98 180 top
C2  22.71,23.93 180 top
C3  22.76,33.08 180 top
C4  11.43,26.25 180 top
C5  11.05,32.65 180 top
C6  22.75,31.53 180 top
C7  46.85,19.1 90 top
C8  45.5,19.55 90 top
C9  28.1,17.85 270 top
C10  37.37,34.6 0 top
C11  35.65,34.6 180 top
C12  13.9,29.45 180 top
C13  13.9,26.25 180 top
C14  41.3,33.4 90 top
C15  38,33.35 270 top
C16  70.4,10.85 270 top
C17  55.15,27.13 180 top
C18  17.4,64.25 270 top
C19  25.44,42.38 270 top
C20  25.95,40.73 0 top
C23  20.62,47.97 0 top
C24  18.33,45.18 180 top
C25  18.33,51.02 270 top
D1  red  [0603N']  6.95,29 270 top
D2  14.65,27.85 180 top
D3  9.05,38.65 90 top
D4  66.5,12 90 top
D5  IN-S63DTLS  [0603N']  57,50 180 top
D6  green  [0603N']  6.95,32 270 top
F1  10.5,34.95 0 top
IC1  24,27.83 270 top
IC2  11.05,29 0 top
IC3  37,22 90 top
IC4  17.35,22.65 90 top
IC5  12.05,22.65 270 top
IC6  23.79,41.24 90 top
IC7  18.08,48.35 0 top
IC9  5,6 90 top
L1  20.17,27.84 90 top
LOGO1  68.75,10.5 0 bottom
LOGO2  10.2,13.05 0 bottom
LOGO3  67.1,6.31 0 bottom
LOGO4  64.81,10.25 0 bottom
Q1  14.7,22.65 180 top
Q2  PMV48XP  [SOT23']  55.28,23.76 180 top
Q3  PMV48XP  [SOT23']  20.15,64.1 180 top
Q4  PMV48XP  [SOT23']  48.1,39.5 270 top
Q5  NM  [SOT23']  62.2,49.4 0 top
Q6  51,18.5 0 top
Q7  39.67,36.03 90 top
R1  8.3,29 270 top
R2  10.6,31.2 180 top
R3  27.25,17.85 90 top
R4  37,33.35 270 top
R5  36.15,33.35 270 top
R6  9.05,37.05 180 top
R7  9.05,40.25 180 top
R8  18.75,24.3 180 top
R9  11.5,19.7 90 top
R10  19.25,22.65 270 top
R11  10.6,19.7 90 top
R12  12.35,14 270 top
R13  42.4,33.4 270 top
R14  20.15,66.65 0 top
R15  44.95,35.35 0 top
R16  61.75,46.85 180 top
R17  56.65,48.45 180 top
R18  8.3,31.65 90 top
R19  22.01,44.03 180 top
R20  18.33,43.27 0 top
R21  61.25,45.49 90 top
R22  63.21,49.6 90 top
R44  16.43,44.41 180 top
R45  12.49,41.37 0 top
R48  12.49,43.4 0 top
R50  16.43,42.38 180 top
RN1  55.7,33.1 270 top
RN3  47.65,35.3 0 top
RN4  27.05,34.6 0 top
RN5  20.2,59.9 180 top
RN6  54.5,18.5 0 top
SW1  8.43,14.44 90 top
SW2  51.22,23.33 270 top
SW3  1.49,30.19 270 top
T1  BSS138PS  [SOT363']  20.24,42.76 0 top
T8  BSS138PS  [SOT363']  14.27,43.02 0 top
X1  3,39 90 top
X2  7.5,23 270 top
X3  55,39 270 top
X4  69,50 270 top
X5  62,39 270 top
X6  68.95,39 270 top
X7  5,61 90 top
X8  69,61 270 top
X9  5,49 90 top
X10  26,54 270 top
X11  48,54 90 top
X12  65,24.5 90 top
X13  9.06,2.12 0 top
X14  65.07,1.87 0 top
X15  9.06,66 0 top
XT1  39.7,33.2 0 top

### Tracks (layer width: path | path; a pad name or v marks a point on that pad's centre or on a via)
1V8_INT
  Top 0.152: R20.1 18.59,43.51 T1.1 19.73,43.91 19.73,46.2 IC7.12
1V8_SCL  (via drill 0.35)
  Top 0.152: T8.1 13.25,43.77 | 13.25,43.77 12.62,43.77 R48.1 | IC7.23 17.44,49.89 17.44,50.38 14.27,50.38 13.25,49.37 v13.25,45.81 | v13.25,44.54 13.25,43.77
  Bottom 0.152: v13.25,45.81 v13.25,44.54
1V8_SDA  (via drill 0.35)
  Top 0.152: T8.4 15.48,41.95 | 15.48,41.95 15.55,41.88 R50.1 | IC7.24 15.89,49.85 v15.28,49.24 | v15.03,41.53 15.45,41.95 15.48,41.95
  Bottom 0.152: v15.03,41.53 15.03,41.49 15.28,41.75 v15.28,49.24
+1V8
  Top 0.152: R48.2 12.61,43.02 T8.2 T8.5 16.29,43.02 R50.2 18.22,42.88 R20.2 19.33,42.77 T1.2 | C23.2 20.5,47.35 IC7.13 19.25,47.35 18.91,47.35 18.9,47.35 18.85,47.35 18.73,47.46 17.57,47.46 17.48,47.37 IC7.8 | IC7.22 17.88,50.97 C25.2 17.83,51.79 18.08,52.03 20.74,52.03 21.51,51.27 21.51,47.47
  Top 0.305: IC6.2 25.86,40.14 C20.2 26.85,40.23 27.09,40.48 27.09,42.76 22.39,47.47 21.51,47.47 C23.2 20.62,46.06 20.11,45.56 20.11,43.02 19.86,42.76 T1.2
+3V3  (via drill 0.3, 0.35)
  Top 0.15: IC1.D5 IC1.C5 | R14.1 v17.4,66.65 | R16.1 v63.15,46.85
  Top 0.152: R22.1 63.21,48.36 Q5.2
  Top 0.3: v48.05,20.05 C7.2 C8.2 IC3.3 | R3.1 v26.5,17.35 | v42.4,34.6 R13.1 | Q2.2 54.33,27 C17.2 v54.2,28.2 | R15.1 v43.75,35.35 | X7.2 v8,60.5 | X8.2 v66,61.5 | RN5.1 RN5.2 RN5.3 RN5.4 v18.2,60.7 | RN6.1 v52.5,17.7 | Q6.5 v51,18.5
  Top 0.305: IC6.3 23.84,42.38 C19.2 24.94,43.01 23.42,44.53 R19.2 22.14,44.66 v22.14,46.45 | R45.2 12.48,40.86 11.6,40.86 11.22,41.24 11.22,44.29 12.1,45.17 16.17,45.17 R44.2 16.05,45.3 v16.05,46.06
  Top 0.6: Q3.2 C18.1 v17.4,66.65 | Q5.2 v63.15,46.85 | C1.1 v23.65,20.7 v23.65,20 | Q4.2 47.3,38.25 v47.3,37.6
  Bottom 0.305: v22.14,46.45 22.14,46.57 16.55,46.57 v16.05,46.06
  pour Top (no thermals): 23.05,21.25 23.05,26.8 23.32,27.07 24.25,27.07 24.25,21.25
  pour Route15 (rank 2): 0,71 74,71 74,-3 0,-3
+5V  (via drill 0.3)
  Top 0.3: IC9.3 v8.15,6 | SW1.3 6.79,16.69 v6.86,16.62
  Bottom 0.3: v8.15,6 6.86,7.29 v6.86,16.62
BOOT  (via drill 0.35)
  Top 0.15: IC3.4 44.05,20.95 49.22,20.95 49.22,20.92 49.22,20.39 v49.32,20.28 | v49.32,23.08 49.32,25.53
  Top 0.152: SW2.3 50.01,20.92 49.22,20.92 | 49.32,25.53 49.37,25.58 SW2.2
  Bottom 0.15: v49.32,23.08 v49.32,20.28
EN  (via drill 0.3, 0.35)
  Top 0.15: IC3.45 C9.1 | C9.1 R3.2 | Q6.2 51,17.1 50.9,17 49.95,17 v48.8,18.15 | v28.1,19.05 C9.1 | 5.94,27.71 3.46,30.19 0.93,30.19 | 0.93,30.19 0.93,32.22 | SW3.4 0.93,28.3 0.93,30.19
  Top 0.152: v8.25,27.3 6.35,27.3 5.94,27.71 5.9,27.75 | v13.75,18.35 R3.2 | SW3.3 0.87,32.22 0.93,32.22
  Bottom 0.15: v48.8,18.15 48.72,18.15 47.62,19.25 44.73,19.25 43.94,18.46 28.69,18.46 v28.1,19.05 | 8.5,22.55 8.25,22.8 v8.25,27.3
  Bottom 0.152: v13.75,18.35 12.7,18.35 8.5,22.55
ENABLE_3V3
  Top 0.15: IC1.D2 24.63,28.2 25.55,28.2 25.9,27.85 25.9,21.35 23.95,19.4 14.06,19.4 12.9,18.24 12.9,13.6 12.8,13.5 R12.2 10.45,13.5 8.79,11.85 8.79,8.14 8.65,8 IC9.5
GND  (via drill 0.3, 0.35, 0.5)
  Top 0.15: D2.1 15.4,28.1 15.3,28 14,28 13.9,28.1 D2.4 | IC1.D4 24.87,27.43 v25.35,26.95 | SW2.4 53,21.05 v53,21.81 | SW2.1 53.02,24.88 v53,24.86
  Top 0.3: IC3.2 45.35,19.2 C8.1 45.95,19.05 C7.1 v48.05,18.15 | IC3.1 v45.1,18.35 | v45.1,17.3 IC3.62 IC3.60 IC3.59 IC3.58 IC3.57 IC3.56 IC3.55 IC3.54 IC3.53 IC3.52 IC3.51 IC3.50 IC3.49 IC3.48 IC3.47 IC3.46 IC3.65 29.95,17.35 v28.9,17.35 C9.2 | IC3.42 v28.9,20.9 | IC3.43 v28.9,20.05 | IC3.64 v30,32.4 | IC3.30 v31.05,32.4 | IC3.63 44.05,31.35 v45.1,31.35 | D4.3 v62.9,13.65 | C17.1 v56.1,28.2 | X12.S3 58,25.55 v57.2,25.55 | X12.S4 v57.2,19.55 | X12.6 v70.55,20.95 | X12.S2 v70.1,17.95 | C16.1 v70.4,12 | X12.S1 v71.1,31.1 | C15.1 37.87,33.98 C10.2 37.37,35.11 v37.37,35.35 | C11.2 v35.15,33.85 | XT1.3 v39.7,37.05 | R17.1 v57.85,48.45 | C14.2 v41.3,34.6 | v52,40.5 X3.1 54.7,40.5 | v59,40.5 X5.1 62.15,40.5 | v65.95,40.5 X6.1 68.95,40.5 | X10.10 v26,45 | v8,59.5 X7.1 4.8,59.5 4.6,59.3 4.2,59.3 | v66,62.5 X8.1 69.2,62.5 69.25,62.55 | R7.1 v10.25,40.25 | R6.1 v10.25,37.05 | v9.25,32.65 C5.2 | R2.1 v11.1,30.15 | C13.2 13.3,26.35 v13.3,27.1 D2.5 | D2.4 13.9,28.95 C12.2 v13.4,30.2 | v20.95,31.9 21.53,31.9 C6.2 21.62,31.25 v20.95,31.25 | v20.95,32.75 21.58,32.75 C3.2 21.59,33.4 v20.95,33.4 | v20.65,22.35 21.38,22.35 C1.2 21.42,21.65 v20.65,21.65 | v20.65,24.3 21.39,24.3 C2.2 21.43,23.6 v20.65,23.6 | 69.2,51.5 X4.1 v66,51.5 | 1.35,34.43 X1.S4 | v35.35,27 IC3.70 v34.3,25.95 | v34.3,24.3 IC3.71 IC3.61 | v34.3,22.65 IC3.72 v35.35,21.6 | v37,21.6 IC3.73 IC3.61 | v38.35,21.6 38.35,22.75 IC3.66 38.6,22.95 v39.7,22.95 | v39.7,24.3 IC3.67 IC3.61 | v38.65,27 IC3.68 v39.7,25.95 | v37,27 IC3.69 IC3.61 | R10.1 R8.1 v19.95,24.3 | D3.2 v9.05,38.65 | v8.15,4 IC9.1 4.45,4 | Q6.1 v50.25,18.5 | v9.9,19.2 R11.1 R9.1 | SW3.2 3.48,28.29 v3.53,28.35 | SW3.1 3.34,32.09 v3.47,32.09
  Top 0.6: 6.5,48.5 X9.1 7.15,48.5 | 6.5,48.5 v5.55,48.5 | v8,48.5 7.15,48.5 | v7.15,47.75 7.15,48.5 | v6.45,47.75 6.45,48.45 6.5,48.5 | X1.A1_B12 6.35,43.32 X1.S2 X1.S3 | X1.B1_A12 6.35,34.68 X1.S1 X1.S4 | C18.2 v17.4,62.2 | IC2.2 11.05,27.1 10.58,26.63 C4.2 10.33,26 7.6,26
  Route2 0.15: v53,21.81 53.13,21.81 | v53,24.86 53,24.73
  Route2 0.3: v3.53,28.35 2.33,29.55 2.33,32.09
  other vias: 22.05,27.85 21.35,27.85 21.7,28.45 21.7,27.25 20.95,27.25 20.95,28.45 5.6,46.9 5.6,51.1 5.5,20.5 5.5,25.6 5.5,26.35 5.5,19.8 4.23,64.35 4.23,57.62 4.23,51.4 4.23,46.57 4.23,10 4.23,2 69.77,64.48 69.77,57.5 69.77,53.56 69.77,46.45 69.64,42.51 69.77,35.4 62.78,35.4 55.54,35.4 55.67,42.26 62.78,42.26 20.25,51.2 18.09,48.41 19.23,45.1 17.33,45.99 21.9,41.17
  pour Top (rank 2, no thermals): 24.3,26.77 24.3,28.9 20.65,28.9 20.65,26.77
  pour Route2 (no thermals): 0,71 74,71 74,-3 0,-3
  pour Top (no thermals): 2.25,65.8 5.75,65.8 5.75,45.2 2.25,45.2
  pour Top (no thermals): 71.75,34.2 68.25,34.2 68.25,41.25 64.5,41.25 64.5,34.85 61.3,34.85 61.3,41.25 57.5,41.25 57.5,34.85 54.3,34.85 54.3,43 68.25,43 68.25,65.8 71.75,65.8
  pour Top (no thermals): 2.25,12.96 12.99,12.96 12.99,1.2 2.25,1.2
  pour Top (rank 2, no thermals): 0.9,27 9.25,27 9.25,19 0.9,19
  pour Route15 (no thermals): 1.6,43.8 1.05,43.8 arc90 0.55,43.3 arc90 1.05,42.8 1.6,42.8 2.15,42.8 arc90 2.65,43.3 arc90 2.15,43.8
  pour Route15 (no thermals): 5.8,43.8 5.25,43.8 arc90 4.75,43.3 arc90 5.25,42.8 5.8,42.8 6.35,42.8 arc90 6.85,43.3 arc90 6.35,43.8
  pour Route15 (no thermals): 5.8,35.2 5.25,35.2 arc90 4.75,34.7 arc90 5.25,34.2 5.8,34.2 6.35,34.2 arc90 6.85,34.7 arc90 6.35,35.2
  pour Route15 (no thermals): 1.6,35.2 1.05,35.2 arc90 0.55,34.7 arc90 1.05,34.2 1.6,34.2 2.15,34.2 arc90 2.65,34.7 arc90 2.15,35.2
  pour Top: 17,53 22,53 23,52 23,46 27,42 27,40 27,39 13,39 11,41 11,48 16,53
I2C_INT  (via drill 0.3)
  Top 0.15: v23.8,36.95 23.8,35.9 24.35,35.35 24.35,32.95 26.55,30.75 26.55,21.4 28.75,19.2 IC3.44
  Top 0.152: T1.6 21.16,43.53 | 21.16,43.53 R19.1 | v20.99,44.56 21.16,44.39 21.16,43.53
  Bottom 0.15: v20.99,44.56 21.5,44.56 23.8,42.26 v23.8,36.95
I2C_SCL  (via drill 0.3)
  Top 0.15: IC3.38 29.3,24.3 27.15,26.45 27.15,31.03 25,33.18 25,35.75 24.8,35.95 v24.8,36.95
  Top 0.152: T8.6 16.28,43.77 R44.1 16.94,43.91 17.19,44.16 17.19,44.83 v17.27,44.83
  Bottom 0.15: v24.8,36.95 24.8,42.57 21.78,45.59 18.03,45.59 v17.27,44.83
I2C_SDA  (via drill 0.3)
  Top 0.15: IC3.41 29.04,21.75 28.4,22.39 28.4,24.78 26.85,26.33 26.85,30.9 24.7,33.05 24.7,35.45 24.3,35.85 v24.3,36.4
  Top 0.152: R45.1 12.97,41.87 T8.3 13.37,41.26 v13.59,41.03
  Bottom 0.15: v24.3,36.4 24.3,42.52 21.6,45.22 20.07,45.22 15.88,41.03 v13.59,41.03
IO2
  Top 0.15: IC3.6 45.39,22.6 50.02,27.23 50.02,29.23 52.29,31.5 52.69,31.9 RN1.4
IO3
  Top 0.15: IC3.7 45.77,23.45 49.73,27.4 49.73,29.36 53.07,32.7 RN1.3
IO4
  Top 0.15: IC3.8 46.2,24.3 49.42,27.52 49.42,29.48 53.44,33.5 RN1.2
IO5
  Top 0.15: IC3.9 46.62,25.15 49.12,27.65 49.12,29.61 53.82,34.3 RN1.1
IO6
  Top 0.15: IC3.10 47.02,26 48.83,27.8 48.83,34.48 RN3.4
IO7
  Top 0.15: IC3.11 47.42,26.85 48.52,27.95 48.52,29.8 48.52,32.67 48.05,33.15 RN3.3
IO_ENABLE  (via drill 0.3)
  Top 0.15: IC3.12 45.7,27.7 47.1,29.1 47.1,32.7 45.45,34.35 R15.2 45.45,39.15 v45.1,39.5 | v47,39.5 Q4.1
  Bottom 0.15: v45.1,39.5 v47,39.5
LED
  Top 0.15: RN6.8 53.3,19.4 | 53.3,19.4 53.3,19.55 | Q6.4 53.3,19.4
  Top 0.152: IC3.5 47.99,21.75 48.43,22.19 50.72,22.19 51.48,21.43 51.48,20.28 51.75,20.01 Q6.4
N$1
  pour Top (no thermals): 24.3,27.35 24.3,27.5 22.7,27.5 21.8,26.6 17.95,26.6 17.95,25.1 22.35,25.1 22.35,26.55 23.15,27.35
N$2
  pour Top (no thermals): 24.3,28.18 24.3,28.3 23.15,28.3 22.4,29.05 22.4,30.6 17.95,30.6 17.95,29.1 21.75,29.1 22.7,28.18
N$3
  Top 0.15: RN1.6 62.75,32.7 65,34.95 65,37.8 65.7,38.5 X6.3
N$4
  Top 0.3: IC2.5 R2.2
N$5
  Top 0.15: IC3.20 39.55,32.5 39.17,32.88 | XT1.1 39.1,32.95 39.17,32.88 | C15.2 38.02,32.88 39.17,32.88
  Top 0.152: Q7.1 39.1,35.35 XT1.1
N$6
  Top 0.15: IC4.2 18.75,22.65 R10.2
N$7
  Top 0.15: R1.1 7.95,29.85 D1.C
N$8
  Top 0.15: IC2.1 8.45,27.85 8.3,28 R1.2
N$9
  Top 0.15: 36.98,34.62 36.9,34.62 C10.1
  Top 0.175: 7.4,39.2 8.3,39.2 D3.4 8.4,39.2 9.7,39.2 D3.3 10.12,39.15 10.45,38.83 33.67,38.83 36.8,35.7 36.8,34.8 36.98,34.62 | C10.1 36.87,33.98 R4.1 | 7.4,39.2 6.95,38.75 X1.A7 | X1.B7 6.9,39.75 7.4,39.25 7.4,39.2
N$10
  Top 0.175: R5.1 C11.1 36.35,34.8 36.35,35.5 33.5,38.35 10.35,38.35 10.15,38.15 D3.1 9.7,38.1 8.4,38.1 D3.6 8.3,38.1 7.4,38.1 7.25,38.25 X1.B6 5.65,38.25 5.55,38.35 5.55,39.15 5.65,39.25 X1.A6
N$11
  Top 0.15: X1.B5 8.35,37.25 R6.2
N$12
  Top 0.15: X1.A5 R7.2
N$13  (via drill 0.3)
  Top 0.3: D3.5 v7.6,38.65
  Top 0.6: X1.A4_B9 v7.6,41.4 7.6,46.95 8.77,48.12 8.77,48.88 8.15,49.5 X9.2 | X1.B4_A9 v7.6,36.6 9.1,35.1 F1.1
  Bottom 0.6: v7.6,36.6 v7.6,38.65 v7.6,41.4
N$14
  Top 0.15: IC5.2 10.75,22.65 10.6,22.5 R11.2
N$15  (via drill 0.3)
  Top 0.15: IC4.3 R8.2 17.65,24.9 v17.5,24.9 | v14.7,24.3 Q1.2
  Bottom 0.15: v17.5,24.9 15.3,24.9 v14.7,24.3
N$16  (via drill 0.3)
  Top 0.15: IC1.C1 IC1.D1 25.28,28.63 v25.35,28.7 | IC1.D3 25.21,27.83 v25.35,27.7
  Top 0.3: IC5.4 12.8,21.75 12.8,18.8 12.13,18.12 12.13,17.84 SW1.6 10.55,16.69 7.52,13.66 7.52,9.64 v8.15,9 | IC9.4 v8.15,7
  Bottom 0.15: v25.35,27.7 v25.35,28.7
  Bottom 0.3: v8.15,7 v8.15,9
  pour Top (no thermals): 15.2,23.4 15.8,23.4 16,23.2 17.03,23.2 17.03,20.5 14.2,20.5 14.2,21.85 13.86,21.85 13.65,22.06 12.7,22.06 12.7,19.7 17.1,19.7 17.75,20.35 17.75,24.35 16.85,25.25 16.85,32.2 18.55,33.9 22.8,33.9 23.15,33.55 23.15,28.8 23.35,28.6 24.25,28.6 24.25,34.55 23.35,35.45 17.25,35.45 14.8,33 14.8,24.15 15.2,24.55
N$17  (via drill 0.3)
  Top 0.15: v14.7,21 Q1.5 | R9.2 v11.5,21 11.15,21.35 IC5.3
  Bottom 0.15: v11.5,21 v14.7,21
N$18
  Top 0.15: IC3.19 40.4,32.85 | 40.4,32.85 40.4,33.1 XT1.2 | C14.1 40.45,32.9 40.4,32.85
  Top 0.152: Q7.2 40.79,35.91 40.68,35.91 40.68,33.84 40.3,33.45 XT1.2
N$19
  Top 0.15: RN6.7 54.1,18.5 | Q6.3 51.75,18.3 51.95,18.5 53.95,18.5 54.05,18.5 54.1,18.5 | 54.1,18.5 59.1,18.5 62.35,15.25 62.35,10.8 62.8,10.35 D4.4
N$20  (via drill 0.3)
  Top 0.6: X3.2 v52,39.5 Q4.3 | v59,39.5 X5.2 | X6.2 v65.9,39.5
  Bottom 0.6: v52,39.5 v59,39.5 v65.9,39.5
N$21  (via drill 0.3)
  Top 0.3: D2.3 C12.1 v14.4,30.2
  Bottom 0.6: v14.4,30.9 v14.4,30.2 14.4,26.77 13.98,26.35 13.98,24.32 v13.95,24.3 v13.25,24.3
N$22  (via drill 0.3)
  Top 0.3: X12.4 v70.55,23.15 | v56.29,23.11 55.84,22.66 Q2.3
  Bottom 0.3: v70.55,23.15 56.33,23.15 v56.29,23.11
N$23
  Top 0.6: X10.1 Q3.3
N$24
  Top 0.152: R22.2 63.16,50.15 63.16,50.5
  Top 0.6: Q5.3 63.16,50.5 X4.2
N$27
  Top 0.15: R18.1 D6.A
N$31
  Top 0.15: X6.4 65.75,37.5 65.3,37.05 65.3,34.83 62.37,31.9 RN1.5
N$32
  Top 0.15: X5.3 58.85,38.5 58.2,37.85 58.2,35 57.5,34.3 RN1.8
N$33
  Top 0.15: RN1.7 57.12,33.5 58.5,34.88 58.5,37.05 58.95,37.5 X5.4
N$34
  Top 0.15: X3.4 49.4,37.5 48.85,36.95 RN3.5
N$35
  Top 0.15: X3.3 49.65,38.5 48.05,36.9 RN3.6
N$36
  Top 0.15: RN3.8 46.45,37.18 45.73,37.91 45.73,41.36 46.32,41.95 49.25,41.95 50.56,43.26 63.01,43.26 66.17,46.42 66.17,49.33 66.35,49.5 X4.3
N$37
  Top 0.15: RN3.7 47.25,36.81 46.02,38.03 46.02,39.45 46.02,41.23 46.44,41.65 49.37,41.65 50.68,42.96 63.13,42.96 67.22,47.05 X4.4
N$38  (via drill 0.3)
  Top 0.15: RN4.6 v27.45,36.85 | v23.6,57.4 21.4,57.4 | 21.4,57.4 13,57.4 7.9,62.5 X7.4 | X8.4 65.52,59.5 63.44,57.41 62.42,56.4 51.24,56.4 50.95,56.69 v50.95,57.4 | 21.4,57.4 RN5.8 RN5.7
  Bottom 0.15: v27.45,36.85 27.45,50.17 23.6,54.02 v23.6,57.4 v50.95,57.4
N$39  (via drill 0.3)
  Top 0.15: RN4.5 v28.25,36.35 | v24.15,56.9 v19,56.9 12.8,56.9 8.2,61.5 X7.3 | v51.45,56.9 62.5,56.9 66.1,60.5 X8.3 | RN5.6 RN5.5 v19,58.15
  Bottom 0.15: v28.25,36.35 28.25,49.79 24.15,53.89 v24.15,56.9 24.2,56.9 v51.45,56.9 | v19,58.15 v19,56.9
N$42  (via drill 0.3)
  Top 0.15: v8.3,32.85 D6.C | Q6.6 50.12,19.52 v48.8,19.52
  Bottom 0.15: v48.8,19.52 48.74,19.52 47.74,19.52 44.61,19.52 44.19,19.11 28.72,19.11 28.3,19.52 27.9,19.52 26.63,18.25 14.56,18.25 13.96,18.85 12.59,18.85 9.75,21.69 9.75,31.4 v8.3,32.85
PD_ENABLE  (via drill 0.3)
  Top 0.15: v35.2,32.9 35.3,32.8 IC3.25 | v36.99,39.41 37.76,40.17 43.15,40.17 47.13,44.16 52.23,44.16 55.4,47.33 55.4,49.9 55.55,50.05 D5.A
  Bottom 0.15: v35.2,32.9 36.82,34.52 36.82,38.87 36.95,39 36.95,39.37 v36.99,39.41
PD_SENSE
  Top 0.15: IC3.18 41.25,31.98 41.88,32.61 | D5.C 57.85,49.25 57.7,49.1 56.3,49.1 56.15,48.95 R17.2 56.15,47.66 52.35,43.86 47.26,43.86 42.08,38.68 42.08,35.14 41.88,34.94
  Top 0.152: 41.88,34.94 41.88,32.61
QWIIC_SCL
  Top 0.15: IC3.36 29.3,26 27.75,27.55 27.75,32.1 27.45,32.4 RN4.3
QWIIC_SDA
  Top 0.15: IC3.35 29.35,26.85 28.05,28.15 28.05,33.6 RN4.4
REGOUT1
  Top 0.152: IC7.10 18.28,45.87 18.38,45.76 C24.2
SD_CS  (via drill 0.3)
  Top 0.15: IC3.14 v45.1,29.4 | v69.95,25.35 X12.2
  Bottom 0.15: v45.1,29.4 45.65,28.85 68.1,28.85 69.95,27 v69.95,25.35
SD_ENABLE  (via drill 0.3)
  Top 0.15: IC3.13 v45.1,28.55 | v55.34,25.8 56.23,24.91 Q2.1
  Bottom 0.15: v45.1,28.55 52.59,28.55 v55.34,25.8
SD_MISO  (via drill 0.3)
  Top 0.15: IC3.17 42.1,31.95 42.4,32.25 R13.2 44.96,32.9 v46.5,31.35 | v71.55,19.85 X12.7
  Bottom 0.15: v46.5,31.35 48.11,29.75 68.6,29.75 71.55,26.8 v71.55,19.85
SD_MOSI  (via drill 0.3)
  Top 0.15: X12.3 v70.5,24.25 | v45.1,30.25 IC3.15
  Bottom 0.15: v70.5,24.25 70.5,26.95 68.3,29.15 46.2,29.15 v45.1,30.25
SD_SCLK  (via drill 0.3)
  Top 0.15: IC3.16 42.95,32.06 43.19,32.3 44.86,32.3 45.6,31.56 45.6,31.55 v45.8,31.35 | v71.05,22.05 X12.5
  Bottom 0.15: v45.8,31.35 47.7,29.45 68.47,29.45 71.05,26.87 v71.05,22.05
UART_ENABLE  (via drill 0.3)
  Top 0.15: 61.25,45.2 61.05,45 59.61,43.56 50.09,43.56 v49.65,43.11 | v34.45,33.85 IC3.26
  Top 0.152: R21.1 61.06,44.99 61.05,45
  Bottom 0.15: v34.45,33.85 34.45,37.62 39.95,43.11 v49.65,43.11
UART_ENABLE1
  Top 0.15: Q5.1 R16.2
  Top 0.152: R16.2 R21.2
UART_RXD  (via drill 0.3)
  Top 0.15: v28.9,22.6 IC3.40 | RN3.1 46.45,33.8 47.4,32.85 47.4,27.65 v47.3,27.55
  Bottom 0.15: v28.9,22.6 33.85,27.55 v47.3,27.55
UART_TXD  (via drill 0.3)
  Top 0.15: v28.9,23.45 IC3.39 | v47.9,28.05 47.9,32.8 47.25,33.45 RN3.2
  Bottom 0.15: v28.9,23.45 33.5,28.05 v47.9,28.05
USB_D+
  Top 0.175: R5.2 IC3.24
USB_D-
  Top 0.175: IC3.23 R4.2
VBAT  (via drill 0.3)
  Top 0.3: D2.6 C13.1 14.4,25.25 14.35,25.25
  Top 0.6: IC2.3 12,26.66 12.28,26.38 C4.1
  Bottom 0.6: v16.1,21 15.43,21 15.43,21.77 14.5,22.7 13.1,22.7 v11.7,24.1 v11.7,24.85
  other vias: 15.4,21
  pour Top (no thermals): 16.7,22.1 15.9,22.1 15.9,22.85 15.65,23.1 14.85,23.1 14.85,20.8 16.7,20.8
  pour Top (no thermals): 11.45,26.75 11.45,24.9 2.6,24.9 2.6,23.55 10.65,23.55 10.65,23.85 12.4,23.85 12.4,25.1 14.5,25.1 14.5,25.7 12.35,25.7 12.35,26.75
VCC_LED  (via drill 0.3)
  Top 0.3: D4.1 C16.2 70.4,9.8 70.1,9.5 63.1,9.5 61.95,10.65 61.95,15.1 59.35,17.7 v56.5,17.7 RN6.4 RN6.3 RN6.2 | R12.1 12.35,15.2 | 12.35,15.2 v12.35,16.15 | SW1.5 10.99,15.2 12.35,15.2
  Bottom 0.3: v56.5,17.7 55.95,17.15 48.27,17.15 46.52,18.9 44.87,18.9 43.87,17.9 14.11,17.9 12.51,16.3 v12.35,16.15
VUSB  (via drill 0.3)  (1 unrouted)
  Top 0.15: D1.A 6.95,28.85 7.1,29 12,29 IC2.4 | R18.2 8.95,32.15 9.3,31.8 12,31.8
  Top 0.3: 12.8,23.9 12.95,23.75 IC5.6 12.68,23.12 12.54,23.12 12.35,22.94 12.35,19 10.9,17.55 10.9,17.48 10.74,17.32 8.12,17.32 7.52,16.72 7.52,15.71 6.95,15.14 5.82,15.14 | IC9.2 v8.15,5 | SW1.2 5.82,15.14 | 5.82,15.14 v5.45,15.14
  Top 0.6: IC2.4 12,31.8 12,32.55 C5.1 | F1.2 C5.1 | 14.4,29.9 14.4,31 12.75,32.65 C5.1
  Bottom 0.3: v8.15,5 5.45,7.7 v5.45,15.14
  pour Top (no thermals): 12.7,22.4 13.8,22.4 13.95,22.25 14.55,22.25 14.55,23.1 14.3,23.1 14.3,24.8 12.7,24.8
XBEE_CS  (via drill 0.3)
  Top 0.15: IC3.29 v31.9,36.95 | v49.35,56.1 X11.7
  Bottom 0.15: v31.9,36.95 49.35,54.4 v49.35,56.1
XBEE_ENABLE  (via drill 0.3)
  Top 0.15: v22.15,65.2 Q3.1 21.1,66.2 R14.2 | IC3.37 29.3,25.15 27.45,27 27.45,31.15 25.3,33.3 25.3,36.1 v25.3,36.4
  Bottom 0.15: v22.15,65.2 22.98,64.38 23.1,64.25 23.1,54.09 25.3,51.89 v25.3,36.4
XBEE_INT  (via drill 0.3)
  Top 0.15: IC3.28 32.75,36.34 v32.78,36.37 | v46.65,44.5 X11.2
  Bottom 0.15: v32.78,36.37 40.91,44.5 v46.65,44.5
XBEE_MISO  (via drill 0.3)
  Top 0.15: IC3.33 29.35,28.55 28.65,29.25 28.65,32.61 30.4,34.36 v30.4,36.4 | v27.35,54.1 X10.4
  Bottom 0.15: v27.35,54.1 30.4,51.05 v30.4,36.4
XBEE_MOSI  (via drill 0.3)
  Top 0.15: IC3.31 29.4,30.25 29.25,30.4 29.25,32.36 31.4,34.51 v31.4,36.4 | v47.95,45 X11.1
  Bottom 0.15: v31.4,36.4 32.1,36.4 40.7,45 v47.95,45
XBEE_RESET  (via drill 0.3)
  Top 0.15: IC3.34 29.35,27.7 28.35,28.7 28.35,32.73 29.9,34.28 v29.9,36.95 | v24.65,54.1 X10.5
  Bottom 0.15: v29.9,36.95 29.9,48.85 v24.65,54.1
XBEE_RXD  (via drill 0.3)
  Top 0.15: v37.88,37.45 28.77,46.56 28.77,57.65 27.35,59.07 X10.2 | IC3.22 v37.85,32.17
  Bottom 0.15: v37.85,32.17 38.42,31.6 38.86,31.6 39.2,31.94 39.2,36.13 v37.88,37.45
XBEE_SCLK  (via drill 0.3)
  Top 0.15: IC3.32 29.4,29.4 28.95,29.85 28.95,32.48 30.9,34.43 v30.9,36.95 | v46.65,56.1 X11.8
  Bottom 0.15: v30.9,36.95 46.65,52.7 v46.65,56.1
XBEE_TXD  (via drill 0.3)
  Top 0.15: IC3.21 v38.7,32.15 | X10.3 27,59 28.48,57.52 28.48,45.64 v37.37,36.75
  Bottom 0.15: v37.37,36.75 38.7,35.42 v38.7,32.15

### Text on the board
tPlace: I2C | I2C | SCL | 1 | 20 | GND | SDA | 3V3 | 3V3 | SDA | GND | SCL | UART | Ext. 5V | IMU | XBEE | Light / Sensor | GND | 3V3 | 5V | RXD | GND | TXD | X / Y / Z | C | B | A | USB | GND | GND | GND | 3V3 | 3V3 | 3V3 | IO7 | IO5 | IO3 | IO6 | IO4 | IO2 | GPIO | Micro-SD | Reset | Boot- / Switch | VBAT | Battery | GND | senseBox | MCU 2.2 | RGB-LED | Off/On | EN_3V3 | VIN_ORED | 5V | VUSB | GND | Ext. On
bPlace: https://sensebox.de/go | open / Hardware